# Altium project B001AA.PrjPcb (part 1 of 3)
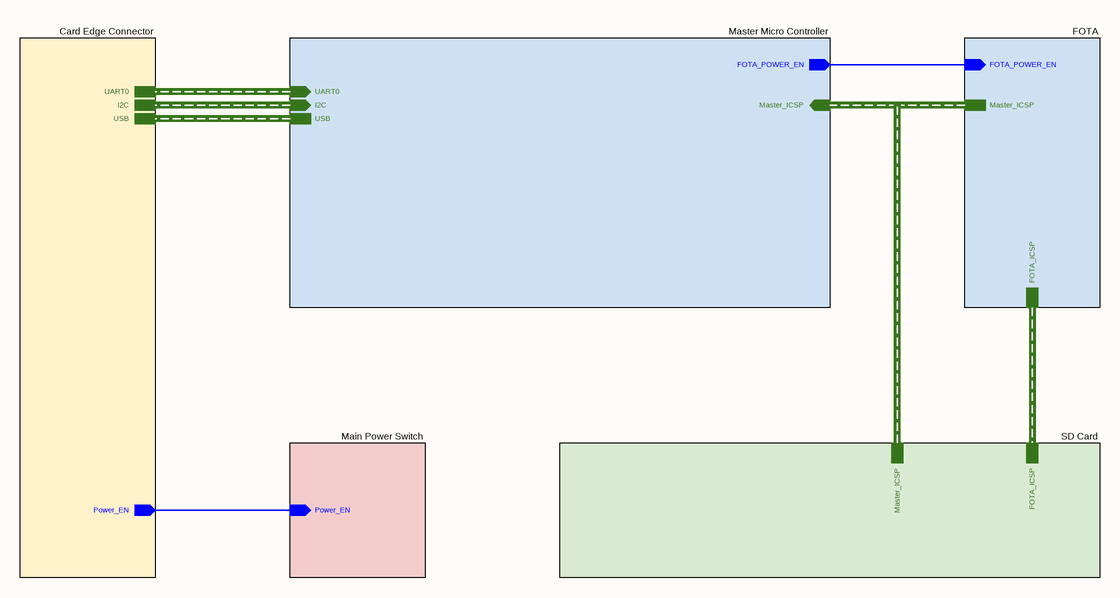
[diagram p0: Blok Diagram.SchDoc]
Address1_: Buyuk Kayacik Mah. 4. OSB; Address2_: 103. Cad. No : 12; Address3_: Selcuklu / Konya; Address4_: Türkiye; Copyright_: Copyright 2022 STF Tarim (Commercial Secret); Customer_: STF Irrigation; Engineer_: Gunce Akkoyun; Git_Repo_Address_: www.github.com/akkoyun/B001AA; Module_ID_: B001AA; Organization_: STF Res-Dev; Product_Desc_: --; Product_ID_: --; Revision_: 00.00.01; Version_: R1
28 sheets, 194 parts. Net scope: hierarchical (ports join the sheet entries above them; power ports are global).
Board file: B001AA.PcbDoc
Sheets:
  Blok Diagram.SchDoc
    Card Edge Connector = Card Edge Connector.SchDoc
      Port L Output Port = Port L Output Port.SchDoc
      Port K Output Port = Port K Output Port.SchDoc
      Port F Output Port = Port F Output Port.SchDoc
      Serial Output Ports = Serial Output Ports.SchDoc
      GSM Output Port = GSM Output Port.SchDoc
    FOTA = FOTA.SchDoc
      FOTA MCU LED Driver = FOTA LED Driver.SchDoc
      FOTA Power Switch = FOTA Microcontroller Power Switch.SchDoc
      FOTA Micro Controller = FOTA Micro Controller.SchDoc
      FOTA Burn Buffer = FOTA Burn Buffer.SchDoc
    Master Micro Controller = Master Micro Controller.SchDoc
      Buzzer = Buzzer.SchDoc
      Master MCU LED Driver = Master MicroController LED Driver.SchDoc
      I2C Network = I2C Block Diagram.SchDoc
        I2C Multiplexer = I2C Multiplexer.SchDoc
        I2C RTC = I2C Real Time Clock.SchDoc
        I2C Serial ID = I2C Serial ID EEPROM.SchDoc
        I2C TH Sensor = I2C Temperature Sensor.SchDoc
      Master MicroController Core = Master Micro Controller Core.SchDoc
      Master MCU UnUsed Pins = UnUsed MicroController Pins.SchDoc
      USB Connector = USB Connector.SchDoc
      USB to Serial Converter = Serial to USB Converter.SchDoc
    SD Card = SD Card Block.SchDoc
      SD Card Multiplexer = SD Card Multiplexer.SchDoc
      SD Card = SD Card.SchDoc
    Main Power Switch = Power Switch.SchDoc

## Sheet Blok Diagram.SchDoc: B001AA Main Block Diagram
size 292 x 193 mm; SheetNumber: 1; SheetTotal: 28

### Sub-sheets
Card Edge Connector = Card Edge Connector.SchDoc: I2C (harness I2C), UART0 (harness UART0), USB (harness USB), Power_EN (out)
FOTA = FOTA.SchDoc: FOTA_ICSP (harness FOTA_ICSP), Master_ICSP (harness Master_ICSP), FOTA_POWER_EN (in)
Main Power Switch = Power Switch.SchDoc: Power_EN (in)
Master Micro Controller = Master Micro Controller.SchDoc: UART0 (in, harness UART0), I2C (in, harness I2C), Master_ICSP (in, harness Master_ICSP), FOTA_POWER_EN (out), USB (harness USB)
SD Card = SD Card Block.SchDoc: Master_ICSP (harness Master_ICSP), FOTA_ICSP (harness FOTA_ICSP)

### Nets
FOTA_POWER_EN: sheet FOTA/FOTA_POWER_EN, sheet Master Micro Controller/FOTA_POWER_EN
Power_EN: sheet Card Edge Connector/Power_EN, sheet Main Power Switch/Power_EN

### Buses and harness runs
harness sheet Card Edge Connector/I2C = sheet Master Micro Controller/I2C
harness sheet Card Edge Connector/UART0 = sheet Master Micro Controller/UART0
harness sheet Card Edge Connector/USB = sheet Master Micro Controller/USB
harness sheet FOTA/FOTA_ICSP = sheet SD Card/FOTA_ICSP
harness sheet FOTA/Master_ICSP = sheet Master Micro Controller/Master_ICSP = sheet SD Card/Master_ICSP

### Notes on the sheet
- © 2021 All rights reserved.
  This document may not, in whole or in part, be copied, photocopied, reproduced, translated or converted to any electronic or machine readable from without prior written permission of Mehmet Günce Akkoyun.
  Engineer contact : akkoyun@me.com
- Property of
- Engineer :
- Date :
- Size :
- A4
- Time :
- Project :
- Page :
- /
- Customer :
- Product ID :
- Module ID :
- Version :
- File :
- Revision :

## Sheet Card Edge Connector.SchDoc: Card Edge Connector
size 292 x 193 mm; SheetNumber: 2; SheetTotal: 28
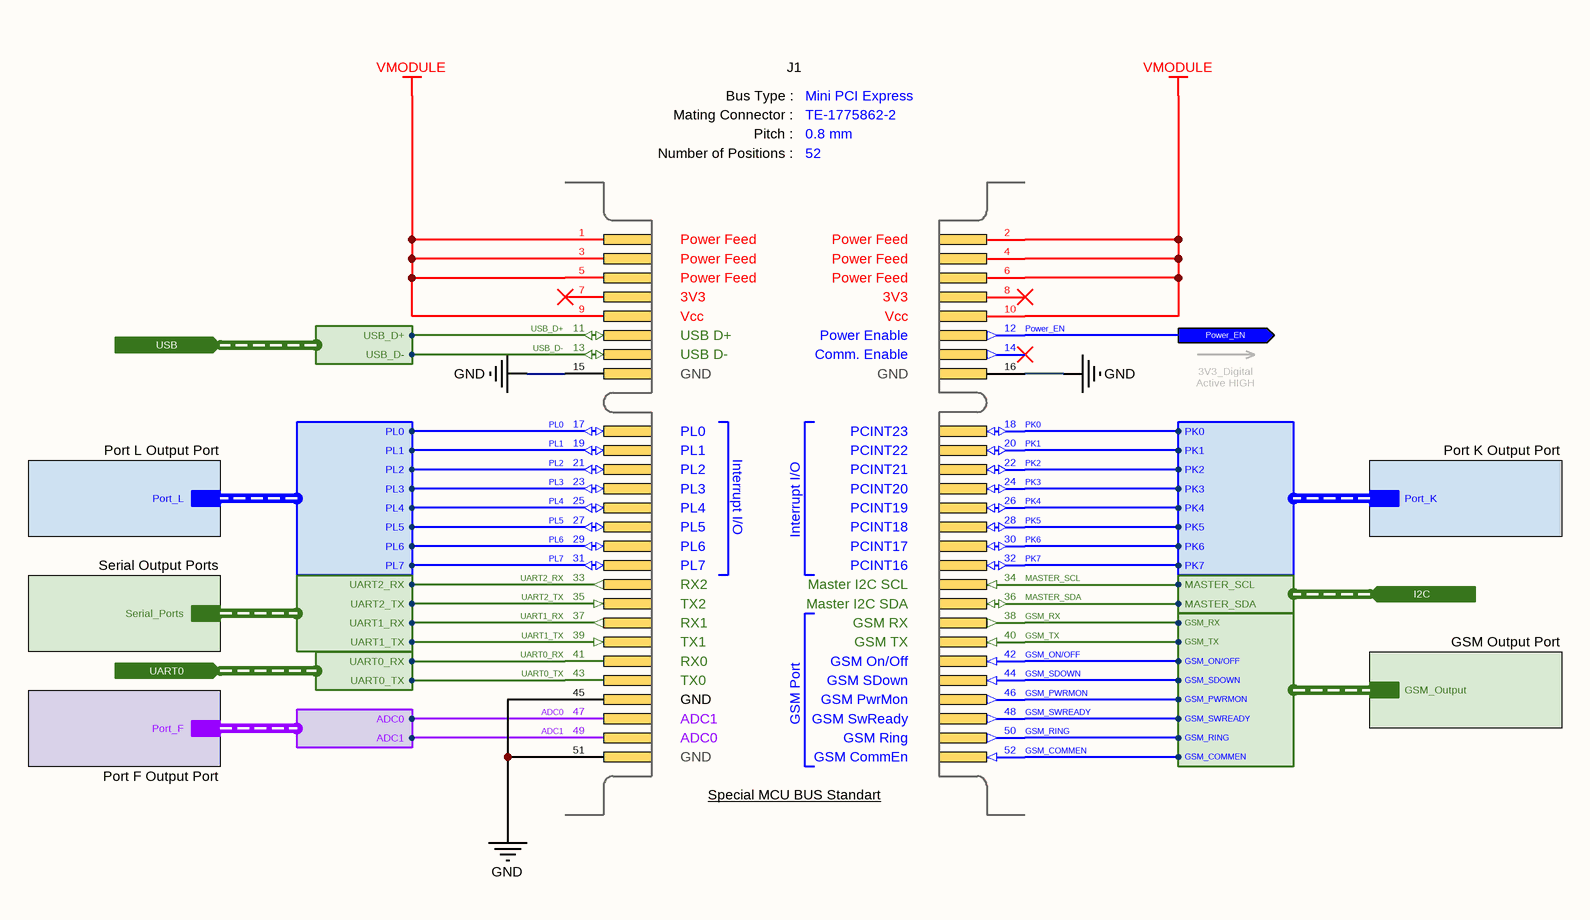
[diagram p1: Card Edge Connector.SchDoc]

### Parts
J1  BUS Type: Mini PCI Express  Mating Connector: TE-1775862-2  Pitch: 0.8 mm  Number of Positions: 52  [PCB - Mini PCI Express]  (hidden comment: PCI-E Connector)  (no BOM)

### Sub-sheets
GSM Output Port = GSM Output Port.SchDoc: GSM_Output (harness GSM_Output)
Port F Output Port = Port F Output Port.SchDoc: Port_F (harness Port_F)
Port K Output Port = Port K Output Port.SchDoc: Port_K (harness Port_K)
Port L Output Port = Port L Output Port.SchDoc: Port_L (harness Port_L)
Serial Output Ports = Serial Output Ports.SchDoc: Serial_Ports (harness Serial_Ports)

### Ports
I2C (in, harness I2C), Power_EN (out), UART0 (in, harness UART0), USB (in, harness USB)

### Harnesses
GSM_Output: GSM_SDOWN, GSM_ON/OFF, GSM_TX, GSM_RX, GSM_PWRMON, GSM_SWREADY, GSM_RING, GSM_COMMEN
Port_L: PL3, PL2, PL1, PL0, PL4, PL5, PL6, PL7
Port_K: PK3, PK2, PK1, PK0, PK4, PK5, PK6, PK7
Port_F: ADC1, ADC0
Serial_Ports: UART1_TX, UART1_RX, UART2_RX, UART2_TX
UART0: UART0_RX, UART0_TX
I2C: MASTER_SDA, MASTER_SCL
USB: USB_D+, USB_D-

### Nets
GND: J1.15(Pin-15) J1.16(Pin-16) J1.45(Pin-45) J1.51(Pin-51)
VMODULE: J1.1(Pin-1) J1.2(Pin-2) J1.3(Pin-3) J1.4(Pin-4) J1.5(Pin-5) J1.6(Pin-6) J1.9(Pin-9) J1.10(Pin-10)
ADC0: J1.47(Pin-47) ; sheet Port F Output Port/Port_F.ADC0
ADC1: J1.49(Pin-49) ; sheet Port F Output Port/Port_F.ADC1
GSM_COMMEN: J1.52(Pin-52) ; sheet GSM Output Port/GSM_Output.GSM_COMMEN
GSM_ON/OFF: J1.42(Pin-42) ; sheet GSM Output Port/GSM_Output.GSM_ON/OFF
GSM_PWRMON: J1.46(Pin-46) ; sheet GSM Output Port/GSM_Output.GSM_PWRMON
GSM_RING: J1.50(Pin-50) ; sheet GSM Output Port/GSM_Output.GSM_RING
GSM_RX: J1.38(Pin-38) ; sheet GSM Output Port/GSM_Output.GSM_RX
GSM_SDOWN: J1.44(Pin-44) ; sheet GSM Output Port/GSM_Output.GSM_SDOWN
GSM_SWREADY: J1.48(Pin-48) ; sheet GSM Output Port/GSM_Output.GSM_SWREADY
GSM_TX: J1.40(Pin-40) ; sheet GSM Output Port/GSM_Output.GSM_TX
MASTER_SCL: J1.34(Pin-34) ; port I2C.MASTER_SCL
MASTER_SDA: J1.36(Pin-36) ; port I2C.MASTER_SDA
PK0: J1.18(Pin-18) ; sheet Port K Output Port/Port_K.PK0
PK1: J1.20(Pin-20) ; sheet Port K Output Port/Port_K.PK1
PK2: J1.22(Pin-22) ; sheet Port K Output Port/Port_K.PK2
PK3: J1.24(Pin-24) ; sheet Port K Output Port/Port_K.PK3
PK4: J1.26(Pin-26) ; sheet Port K Output Port/Port_K.PK4
PK5: J1.28(Pin-28) ; sheet Port K Output Port/Port_K.PK5
PK6: J1.30(Pin-30) ; sheet Port K Output Port/Port_K.PK6
PK7: J1.32(Pin-32) ; sheet Port K Output Port/Port_K.PK7
PL0: J1.17(Pin-17) ; sheet Port L Output Port/Port_L.PL0
PL1: J1.19(Pin-19) ; sheet Port L Output Port/Port_L.PL1
PL2: J1.21(Pin-21) ; sheet Port L Output Port/Port_L.PL2
PL3: J1.23(Pin-23) ; sheet Port L Output Port/Port_L.PL3
PL4: J1.25(Pin-25) ; sheet Port L Output Port/Port_L.PL4
PL5: J1.27(Pin-27) ; sheet Port L Output Port/Port_L.PL5
PL6: J1.29(Pin-29) ; sheet Port L Output Port/Port_L.PL6
PL7: J1.31(Pin-31) ; sheet Port L Output Port/Port_L.PL7
Power_EN: J1.12(Pin-12) ; port Power_EN
UART0_RX: J1.41(Pin-41) ; port UART0.UART0_RX
UART0_TX: J1.43(Pin-43) ; port UART0.UART0_TX
UART1_RX: J1.37(Pin-37) ; sheet Serial Output Ports/Serial_Ports.UART1_RX
UART1_TX: J1.39(Pin-39) ; sheet Serial Output Ports/Serial_Ports.UART1_TX
UART2_RX: J1.33(Pin-33) ; sheet Serial Output Ports/Serial_Ports.UART2_RX
UART2_TX: J1.35(Pin-35) ; sheet Serial Output Ports/Serial_Ports.UART2_TX
USB_D+: J1.11(Pin-11) ; port USB.USB_D+
USB_D-: J1.13(Pin-13) ; port USB.USB_D-

Not connected (* = marked no-connect by the designer): J1 7(Pin-7)* 8(Pin-8)* 14(Pin-14)*

### Notes on the sheet
- 3V3_Digital
  Active HIGH
- © 2021 All rights reserved.
  This document may not, in whole or in part, be copied, photocopied, reproduced, translated or converted to any electronic or machine readable from without prior written permission of Mehmet Günce Akkoyun.
  Engineer contact : akkoyun@me.com
- Property of
- Engineer :
- Date :
- Size :
- A4
- Time :
- Project :
- Page :
- /
- Customer :
- Product ID :
- Module ID :
- Version :
- File :
- Revision :
- (in symbol Connector - Mini PCI-E [MCU]) Bus Type :; Mating Connector :; Pitch :; Number of Positions :; Power Feed; 3V3; Vcc; USB D+; Power Enable; USB D-; Comm. Enable; GND; PL0; PCINT23; PL1; PCINT22; Interrupt I/O; PL2; PCINT21; PL3; PCINT20; PL4; PCINT19; PL5; PCINT18; PL6; PCINT17; PL7; PCINT16; RX2; Master I2C SCL; TX2; Master I2C SDA; RX1; GSM RX; TX1; GSM TX; RX0; GSM Port; GSM On/Off; TX0; GSM SDown; GSM PwrMon; ADC1; GSM SwReady; ADC0; GSM Ring; GSM CommEn; Special MCU BUS Standart

### Library data of the parts
J1 = Connector - Mini PCI-E [MCU]: Mini PCI-Express gold finger connector.; System: Connector

## Sheet Port L Output Port.SchDoc: Port L Output Port
size 292 x 193 mm; SheetNumber: 5; SheetTotal: 28
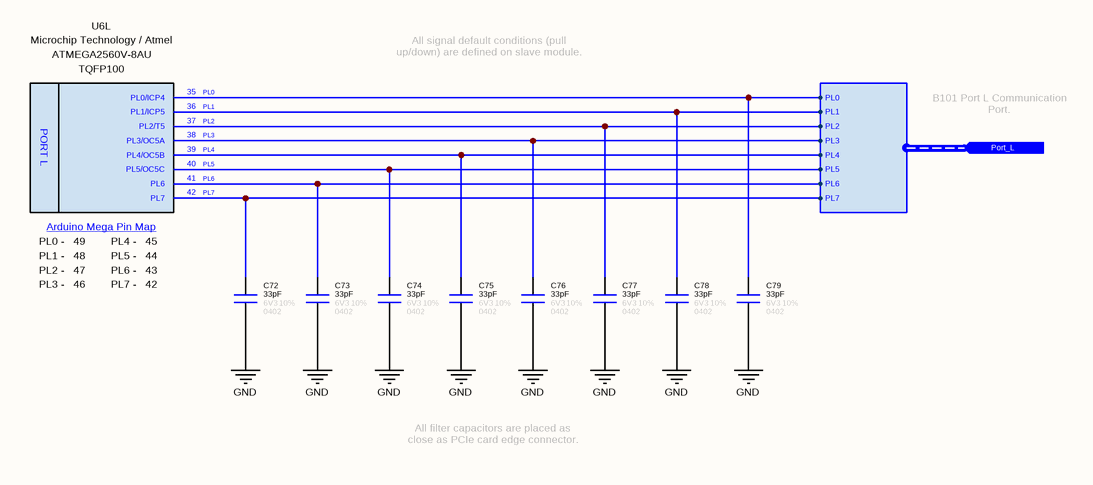
[diagram p2: Port L Output Port.SchDoc]

### Parts
C72  value 33pF  Tolerance: 10%  Case: 0402  Voltage: 6V3  [CAPACITOR_0402]  (hidden comment: Capacitor - 33pF [0402] (Ceramic))
C73  value 33pF  Tolerance: 10%  Case: 0402  Voltage: 6V3  [CAPACITOR_0402]  (hidden comment: Capacitor - 33pF [0402] (Ceramic))
C74  value 33pF  Tolerance: 10%  Case: 0402  Voltage: 6V3  [CAPACITOR_0402]  (hidden comment: Capacitor - 33pF [0402] (Ceramic))
C75  value 33pF  Tolerance: 10%  Case: 0402  Voltage: 6V3  [CAPACITOR_0402]  (hidden comment: Capacitor - 33pF [0402] (Ceramic))
C76  value 33pF  Tolerance: 10%  Case: 0402  Voltage: 6V3  [CAPACITOR_0402]  (hidden comment: Capacitor - 33pF [0402] (Ceramic))
C77  value 33pF  Tolerance: 10%  Case: 0402  Voltage: 6V3  [CAPACITOR_0402]  (hidden comment: Capacitor - 33pF [0402] (Ceramic))
C78  value 33pF  Tolerance: 10%  Case: 0402  Voltage: 6V3  [CAPACITOR_0402]  (hidden comment: Capacitor - 33pF [0402] (Ceramic))
C79  value 33pF  Tolerance: 10%  Case: 0402  Voltage: 6V3  [CAPACITOR_0402]  (hidden comment: Capacitor - 33pF [0402] (Ceramic))
U6  Manufacturer Name: Microchip Technology / Atmel  Case: TQFP100  [TQFP-100]  (hidden comment: ATMEGA2560V-8AU)  (part L of 16)

### Ports
Port_L (in, harness Port_L)

### Harnesses
Port_L: PL3, PL2, PL1, PL0, PL4, PL5, PL6, PL7

### Nets
GND: C72.1 C73.1 C74.1 C75.1 C76.1 C77.1 C78.1 C79.1
PL0: C79.2 U6.35(PL0/ICP4) ; port Port_L.PL0
PL1: C78.2 U6.36(PL1/ICP5) ; port Port_L.PL1
PL2: C77.2 U6.37(PL2/T5) ; port Port_L.PL2
PL3: C76.2 U6.38(PL3/OC5A) ; port Port_L.PL3
PL4: C75.2 U6.39(PL4/OC5B) ; port Port_L.PL4
PL5: C74.2 U6.40(PL5/OC5C) ; port Port_L.PL5
PL6: C73.2 U6.41(PL6) ; port Port_L.PL6
PL7: C72.2 U6.42(PL7) ; port Port_L.PL7

### Notes on the sheet
- All signal default conditions (pull up/down) are defined on slave module.
- B101 Port L Communication Port.
- All filter capacitors are placed as close as PCIe card edge connector.
- © 2021 All rights reserved.
  This document may not, in whole or in part, be copied, photocopied, reproduced, translated or converted to any electronic or machine readable from without prior written permission of Mehmet Günce Akkoyun.
  Engineer contact : akkoyun@me.com
- Property of
- Engineer :
- Date :
- Size :
- A4
- Time :
- Project :
- Page :
- /
- Customer :
- Product ID :
- Module ID :
- Version :
- File :
- Revision :
- (in symbol IC - AtMega2560V-8AU, part L) PORT L; Arduino Mega Pin Map; PL0 -; PL4 -; PL1 -; PL5 -; PL2 -; PL6 -; PL3 -; PL7 -

### Library data of the parts
C72-C79 = Capacitor - 33pF [0402-6V3]: Manufacturer Name: Kemet; Manufacturer Part Number: C0402C330J9RACAUTO; ComponentLink1Description: DataSheet; ComponentLink1URL: https://api.kemet.com/component-edge/download/datasheet/C0402C330J9RACAUTO.pdf; ComponentLink2Description: Mouser; ComponentLink2URL: https://www.mouser.com/Search/Refine.aspx?Keyword=80-C0402C330J9RAUTO
U6 = IC - AtMega2560V-8AU: ATmega Series 256 KB Flash 8 KB SRAM 8 MHz 8-Bit Microcontroller - TQFP-100; Program Memory Size: 256 kB; Core: AVR; Operating Supply Voltage: 2.7 V to 5.5 V; Maximum Clock Frequency: 8 MHz; Maximum Operating Temperature: + 85 C; Product Type: MicroControllers; Minimum Operating Temperature: - 40 C; Manufacturer Part Number: ATMEGA2560V-8AU

## Sheet Port K Output Port.SchDoc: Port K Output Port
size 292 x 193 mm; SheetNumber: 4; SheetTotal: 28
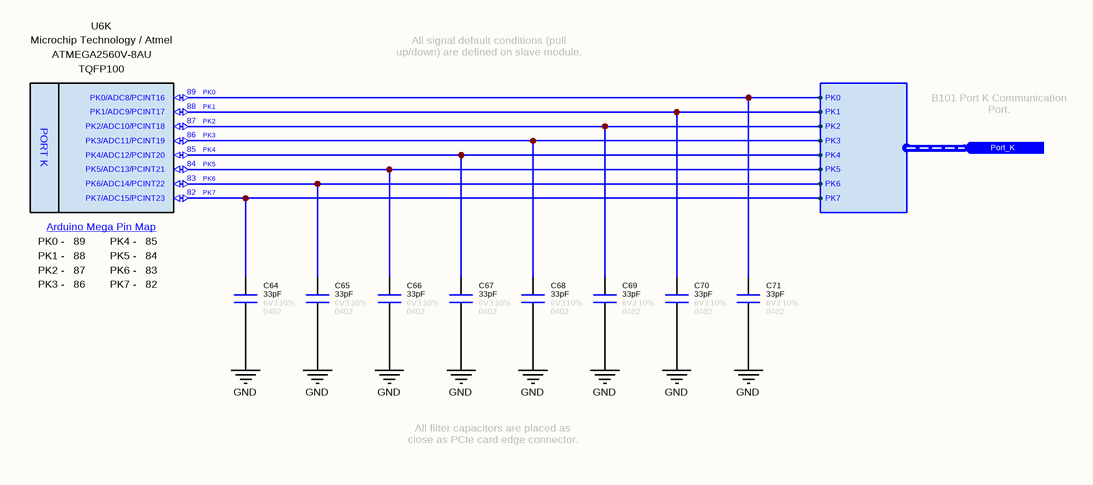
[diagram p3: Port K Output Port.SchDoc]

### Parts
C64  value 33pF  Tolerance: 10%  Case: 0402  Voltage: 6V3  [CAPACITOR_0402]  (hidden comment: Capacitor - 33pF [0402] (Ceramic))
C65  value 33pF  Tolerance: 10%  Case: 0402  Voltage: 6V3  [CAPACITOR_0402]  (hidden comment: Capacitor - 33pF [0402] (Ceramic))
C66  value 33pF  Tolerance: 10%  Case: 0402  Voltage: 6V3  [CAPACITOR_0402]  (hidden comment: Capacitor - 33pF [0402] (Ceramic))
C67  value 33pF  Tolerance: 10%  Case: 0402  Voltage: 6V3  [CAPACITOR_0402]  (hidden comment: Capacitor - 33pF [0402] (Ceramic))
C68  value 33pF  Tolerance: 10%  Case: 0402  Voltage: 6V3  [CAPACITOR_0402]  (hidden comment: Capacitor - 33pF [0402] (Ceramic))
C69  value 33pF  Tolerance: 10%  Case: 0402  Voltage: 6V3  [CAPACITOR_0402]  (hidden comment: Capacitor - 33pF [0402] (Ceramic))
C70  value 33pF  Tolerance: 10%  Case: 0402  Voltage: 6V3  [CAPACITOR_0402]  (hidden comment: Capacitor - 33pF [0402] (Ceramic))
C71  value 33pF  Tolerance: 10%  Case: 0402  Voltage: 6V3  [CAPACITOR_0402]  (hidden comment: Capacitor - 33pF [0402] (Ceramic))
U6  Manufacturer Name: Microchip Technology / Atmel  Case: TQFP100  [TQFP-100]  (hidden comment: ATMEGA2560V-8AU)  (part K of 16)

### Ports
Port_K (in, harness Port_K)

### Harnesses
Port_K: PK3, PK2, PK1, PK0, PK4, PK5, PK6, PK7

### Nets
GND: C64.1 C65.1 C66.1 C67.1 C68.1 C69.1 C70.1 C71.1
PK0: C71.2 U6.89(PK0/ADC8/PCINT16) ; port Port_K.PK0
PK1: C70.2 U6.88(PK1/ADC9/PCINT17) ; port Port_K.PK1
PK2: C69.2 U6.87(PK2/ADC10/PCINT18) ; port Port_K.PK2
PK3: C68.2 U6.86(PK3/ADC11/PCINT19) ; port Port_K.PK3
PK4: C67.2 U6.85(PK4/ADC12/PCINT20) ; port Port_K.PK4
PK5: C66.2 U6.84(PK5/ADC13/PCINT21) ; port Port_K.PK5
PK6: C65.2 U6.83(PK6/ADC14/PCINT22) ; port Port_K.PK6
PK7: C64.2 U6.82(PK7/ADC15/PCINT23) ; port Port_K.PK7

### Notes on the sheet
- All signal default conditions (pull up/down) are defined on slave module.
- B101 Port K Communication Port.
- All filter capacitors are placed as close as PCIe card edge connector.
- © 2021 All rights reserved.
  This document may not, in whole or in part, be copied, photocopied, reproduced, translated or converted to any electronic or machine readable from without prior written permission of Mehmet Günce Akkoyun.
  Engineer contact : akkoyun@me.com
- Property of
- Engineer :
- Date :
- Size :
- A4
- Time :
- Project :
- Page :
- /
- Customer :
- Product ID :
- Module ID :
- Version :
- File :
- Revision :
- (in symbol IC - AtMega2560V-8AU, part K) PORT K; Arduino Mega Pin Map; PK0 -; PK4 -; PK1 -; PK5 -; PK2 -; PK6 -; PK3 -; PK7 -

### Library data of the parts
C64-C71 = Capacitor - 33pF [0402-6V3]: as C72 on sheet Port L Output Port; ComponentLink1Description: DataSheet; ComponentLink1URL: https://api.kemet.com/component-edge/download/datasheet/C0402C330J9RACAUTO.pdf; ComponentLink2Description: Mouser; ComponentLink2URL: https://www.mouser.com/Search/Refine.aspx?Keyword=80-C0402C330J9RAUTO
U6 = IC - AtMega2560V-8AU: as U6 on sheet Port L Output Port; Maximum Operating Temperature: + 85 C; Product Type: MicroControllers; Minimum Operating Temperature: - 40 C; Manufacturer Part Number: ATMEGA2560V-8AU

## Sheet Port F Output Port.SchDoc: Port F Output Port
size 292 x 193 mm; SheetNumber: 6; SheetTotal: 28
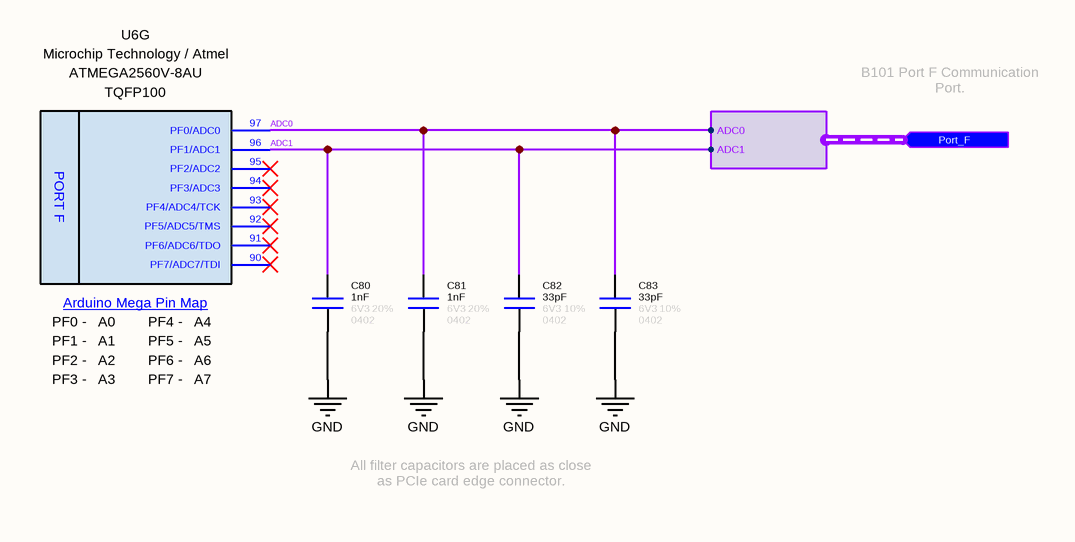
[diagram p4: Port F Output Port.SchDoc]

### Parts
C80  value 1nF  Tolerance: 20%  Case: 0402  Voltage: 6V3  [CAPACITOR_0402]  (hidden comment: Capacitor - 1nF [0402] (Ceramic))
C81  value 1nF  Tolerance: 20%  Case: 0402  Voltage: 6V3  [CAPACITOR_0402]  (hidden comment: Capacitor - 1nF [0402] (Ceramic))
C82  value 33pF  Tolerance: 10%  Case: 0402  Voltage: 6V3  [CAPACITOR_0402]  (hidden comment: Capacitor - 33pF [0402] (Ceramic))
C83  value 33pF  Tolerance: 10%  Case: 0402  Voltage: 6V3  [CAPACITOR_0402]  (hidden comment: Capacitor - 33pF [0402] (Ceramic))
U6  Manufacturer Name: Microchip Technology / Atmel  Case: TQFP100  [TQFP-100]  (hidden comment: ATMEGA2560V-8AU)  (part G of 16)

### Ports
Port_F (in, harness Port_F)

### Harnesses
Port_F: ADC1, ADC0

### Nets
GND: C80.1 C81.1 C82.1 C83.1
ADC0: C81.2 C83.2 U6.97(PF0/ADC0) ; port Port_F.ADC0
ADC1: C80.2 C82.2 U6.96(PF1/ADC1) ; port Port_F.ADC1

Not connected (* = marked no-connect by the designer): U6 90(PF7/ADC7/TDI)* 91(PF6/ADC6/TDO)* 92(PF5/ADC5/TMS)* 93(PF4/ADC4/TCK)* 94(PF3/ADC3)* 95(PF2/ADC2)*

### Notes on the sheet
- B101 Port F Communication Port.
- All filter capacitors are placed as close as PCIe card edge connector.
- © 2021 All rights reserved.
  This document may not, in whole or in part, be copied, photocopied, reproduced, translated or converted to any electronic or machine readable from without prior written permission of Mehmet Günce Akkoyun.
  Engineer contact : akkoyun@me.com
- Property of
- Engineer :
- Date :
- Size :
- A4
- Time :
- Project :
- Page :
- /
- Customer :
- Product ID :
- Module ID :
- Version :
- File :
- Revision :
- (in symbol IC - AtMega2560V-8AU, part G) PORT F; Arduino Mega Pin Map; PF0 -; A0; PF4 -; A4; PF1 -; A1; PF5 -; A5; PF2 -; A2; PF6 -; A6; PF3 -; A3; PF7 -; A7

### Library data of the parts
C80 C81 = Capacitor - 1nF [0402-6V3]: Manufacturer Name: AVX; Manufacturer Part Number: 04026C102MAT2A; ComponentLink1Description: DataSheet; ComponentLink1URL: https://www.mouser.com.tr/datasheet/2/40/X7RDielectric-777024.pdf
C82 C83 = Capacitor - 33pF [0402-6V3]: as C72 on sheet Port L Output Port; ComponentLink1Description: DataSheet; ComponentLink1URL: https://api.kemet.com/component-edge/download/datasheet/C0402C330J9RACAUTO.pdf; ComponentLink2Description: Mouser; ComponentLink2URL: https://www.mouser.com/Search/Refine.aspx?Keyword=80-C0402C330J9RAUTO
U6 = IC - AtMega2560V-8AU: as U6 on sheet Port L Output Port; Maximum Operating Temperature: + 85 C; Product Type: MicroControllers; Minimum Operating Temperature: - 40 C; Manufacturer Part Number: ATMEGA2560V-8AU

## Sheet Serial Output Ports.SchDoc: Serial Output Ports
size 292 x 193 mm; SheetNumber: 7; SheetTotal: 28
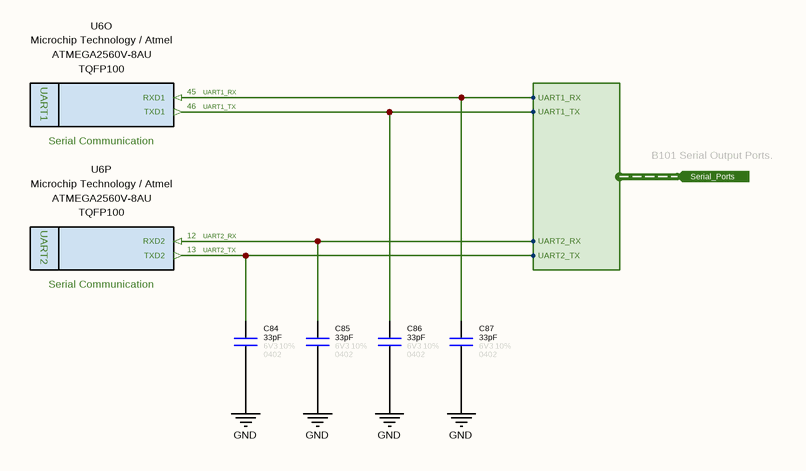
[diagram p5: Serial Output Ports.SchDoc]

### Parts
C84  value 33pF  Tolerance: 10%  Case: 0402  Voltage: 6V3  [CAPACITOR_0402]  (hidden comment: Capacitor - 33pF [0402] (Ceramic))
C85  value 33pF  Tolerance: 10%  Case: 0402  Voltage: 6V3  [CAPACITOR_0402]  (hidden comment: Capacitor - 33pF [0402] (Ceramic))
C86  value 33pF  Tolerance: 10%  Case: 0402  Voltage: 6V3  [CAPACITOR_0402]  (hidden comment: Capacitor - 33pF [0402] (Ceramic))
C87  value 33pF  Tolerance: 10%  Case: 0402  Voltage: 6V3  [CAPACITOR_0402]  (hidden comment: Capacitor - 33pF [0402] (Ceramic))
U6  Manufacturer Name: Microchip Technology / Atmel  Case: TQFP100  [TQFP-100]  (hidden comment: ATMEGA2560V-8AU)  (parts O,P of 16)

### Ports
Serial_Ports (in, harness Serial_Ports)

### Harnesses
Serial_Ports: UART1_TX, UART1_RX, UART2_RX, UART2_TX

### Nets
GND: C84.1 C85.1 C86.1 C87.1
UART1_RX: C87.2 U6.45(RXD1) ; port Serial_Ports.UART1_RX
UART1_TX: C86.2 U6.46(TXD1) ; port Serial_Ports.UART1_TX
UART2_RX: C85.2 U6.12(RXD2) ; port Serial_Ports.UART2_RX
UART2_TX: C84.2 U6.13(TXD2) ; port Serial_Ports.UART2_TX

### Notes on the sheet
- B101 Serial Output Ports.
- © 2021 All rights reserved.
  This document may not, in whole or in part, be copied, photocopied, reproduced, translated or converted to any electronic or machine readable from without prior written permission of Mehmet Günce Akkoyun.
  Engineer contact : akkoyun@me.com
- Property of
- Engineer :
- Date :
- Size :
- A4
- Time :
- Project :
- Page :
- /
- Customer :
- Product ID :
- Module ID :
- Version :
- File :
- Revision :
- (in symbol IC - AtMega2560V-8AU, part O) UART1; Serial Communication
- (in symbol IC - AtMega2560V-8AU, part P) UART2; Serial Communication

### Library data of the parts
C84-C87 = Capacitor - 33pF [0402-6V3]: as C72 on sheet Port L Output Port; ComponentLink1Description: DataSheet; ComponentLink1URL: https://api.kemet.com/component-edge/download/datasheet/C0402C330J9RACAUTO.pdf; ComponentLink2Description: Mouser; ComponentLink2URL: https://www.mouser.com/Search/Refine.aspx?Keyword=80-C0402C330J9RAUTO
U6 = IC - AtMega2560V-8AU: as U6 on sheet Port L Output Port; Maximum Operating Temperature: + 85 C; Product Type: MicroControllers; Minimum Operating Temperature: - 40 C; Manufacturer Part Number: ATMEGA2560V-8AU

## Sheet GSM Output Port.SchDoc: GSM Output Port
size 292 x 193 mm; SheetNumber: 3; SheetTotal: 28
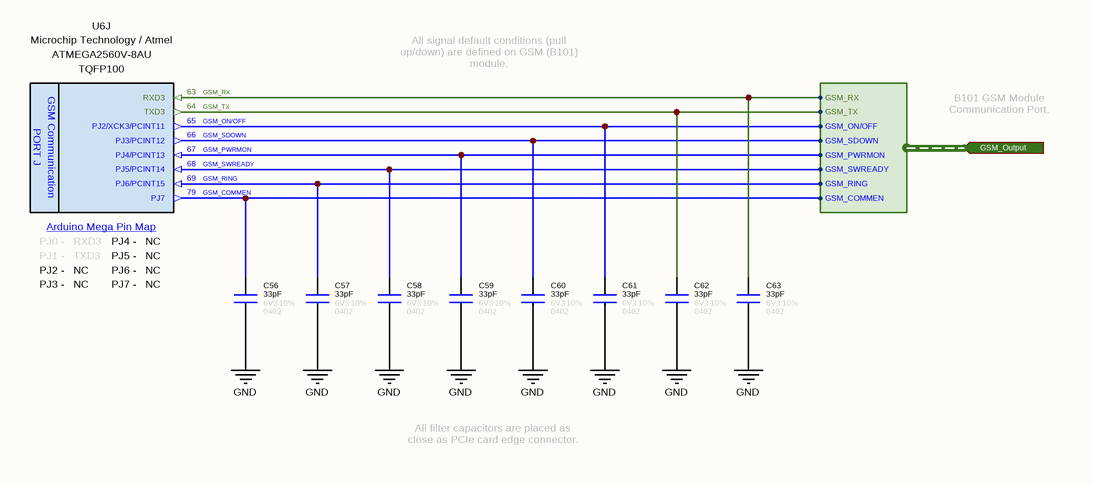
[diagram p6: GSM Output Port.SchDoc]

### Parts
C56  value 33pF  Tolerance: 10%  Case: 0402  Voltage: 6V3  [CAPACITOR_0402]  (hidden comment: Capacitor - 33pF [0402] (Ceramic))
C57  value 33pF  Tolerance: 10%  Case: 0402  Voltage: 6V3  [CAPACITOR_0402]  (hidden comment: Capacitor - 33pF [0402] (Ceramic))
C58  value 33pF  Tolerance: 10%  Case: 0402  Voltage: 6V3  [CAPACITOR_0402]  (hidden comment: Capacitor - 33pF [0402] (Ceramic))
C59  value 33pF  Tolerance: 10%  Case: 0402  Voltage: 6V3  [CAPACITOR_0402]  (hidden comment: Capacitor - 33pF [0402] (Ceramic))
C60  value 33pF  Tolerance: 10%  Case: 0402  Voltage: 6V3  [CAPACITOR_0402]  (hidden comment: Capacitor - 33pF [0402] (Ceramic))
C61  value 33pF  Tolerance: 10%  Case: 0402  Voltage: 6V3  [CAPACITOR_0402]  (hidden comment: Capacitor - 33pF [0402] (Ceramic))
C62  value 33pF  Tolerance: 10%  Case: 0402  Voltage: 6V3  [CAPACITOR_0402]  (hidden comment: Capacitor - 33pF [0402] (Ceramic))
C63  value 33pF  Tolerance: 10%  Case: 0402  Voltage: 6V3  [CAPACITOR_0402]  (hidden comment: Capacitor - 33pF [0402] (Ceramic))
U6  Manufacturer Name: Microchip Technology / Atmel  Case: TQFP100  [TQFP-100]  (hidden comment: ATMEGA2560V-8AU)  (part J of 16)

### Ports
GSM_Output (in, harness GSM_Output)

### Harnesses
GSM_Output: GSM_SDOWN, GSM_ON/OFF, GSM_TX, GSM_RX, GSM_PWRMON, GSM_SWREADY, GSM_RING, GSM_COMMEN

### Nets
GND: C56.1 C57.1 C58.1 C59.1 C60.1 C61.1 C62.1 C63.1
GSM_COMMEN: C56.2 U6.79(PJ7) ; port GSM_Output.GSM_COMMEN
GSM_ON/OFF: C61.2 U6.65(PJ2/XCK3/PCINT11) ; port GSM_Output.GSM_ON/OFF
GSM_PWRMON: C59.2 U6.67(PJ4/PCINT13) ; port GSM_Output.GSM_PWRMON
GSM_RING: C57.2 U6.69(PJ6/PCINT15) ; port GSM_Output.GSM_RING
GSM_RX: C63.2 U6.63(RXD3) ; port GSM_Output.GSM_RX
GSM_SDOWN: C60.2 U6.66(PJ3/PCINT12) ; port GSM_Output.GSM_SDOWN
GSM_SWREADY: C58.2 U6.68(PJ5/PCINT14) ; port GSM_Output.GSM_SWREADY
GSM_TX: C62.2 U6.64(TXD3) ; port GSM_Output.GSM_TX

### Notes on the sheet
- All signal default conditions (pull up/down) are defined on GSM (B101) module.
- B101 GSM Module Communication Port.
- All filter capacitors are placed as close as PCIe card edge connector.
- © 2021 All rights reserved.
  This document may not, in whole or in part, be copied, photocopied, reproduced, translated or converted to any electronic or machine readable from without prior written permission of Mehmet Günce Akkoyun.
  Engineer contact : akkoyun@me.com
- Property of
- Engineer :
- Date :
- Size :
- A4
- Time :
- Project :
- Page :
- /
- Customer :
- Product ID :
- Module ID :
- Version :
- File :
- Revision :
- (in symbol IC - AtMega2560V-8AU, part J) PORT J; GSM Communication; Arduino Mega Pin Map; PJ0 -; PJ4 -; NC; PJ1 -; PJ5 -; PJ2 -; PJ6 -; PJ3 -; PJ7 -

### Library data of the parts
C56-C63 = Capacitor - 33pF [0402-6V3]: as C72 on sheet Port L Output Port; ComponentLink1Description: DataSheet; ComponentLink1URL: https://api.kemet.com/component-edge/download/datasheet/C0402C330J9RACAUTO.pdf; ComponentLink2Description: Mouser; ComponentLink2URL: https://www.mouser.com/Search/Refine.aspx?Keyword=80-C0402C330J9RAUTO
U6 = IC - AtMega2560V-8AU: as U6 on sheet Port L Output Port; Maximum Operating Temperature: + 85 C; Product Type: MicroControllers; Minimum Operating Temperature: - 40 C; Manufacturer Part Number: ATMEGA2560V-8AU

## Sheet FOTA.SchDoc: FOTA
size 292 x 193 mm; SheetNumber: 21; SheetTotal: 28
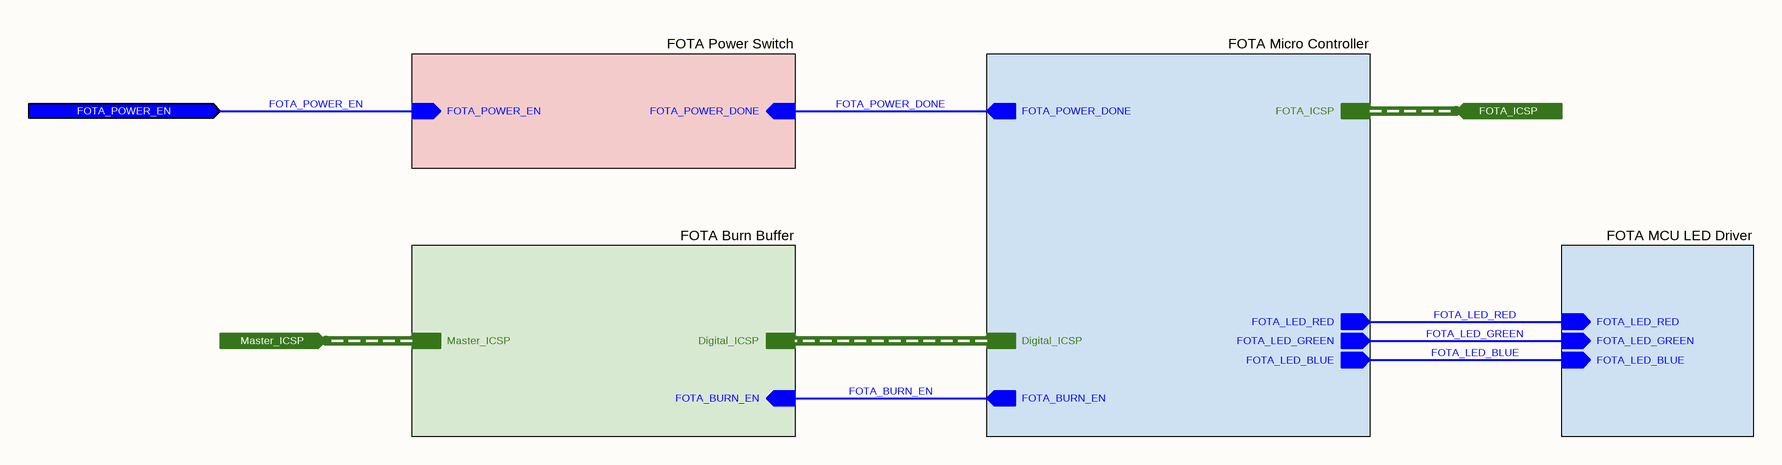
[diagram p7: FOTA.SchDoc]

### Sub-sheets
FOTA Burn Buffer = FOTA Burn Buffer.SchDoc: Digital_ICSP (harness Digital_ICSP), FOTA_BURN_EN (in), Master_ICSP (harness Master_ICSP)
FOTA MCU LED Driver = FOTA LED Driver.SchDoc: FOTA_LED_RED (in), FOTA_LED_BLUE (in), FOTA_LED_GREEN (in)
FOTA Micro Controller = FOTA Micro Controller.SchDoc: FOTA_BURN_EN (out), FOTA_POWER_DONE (out), FOTA_LED_RED (out), FOTA_LED_GREEN (out), FOTA_LED_BLUE (out), Digital_ICSP (harness Digital_ICSP), FOTA_ICSP (harness FOTA_ICSP)
FOTA Power Switch = FOTA Microcontroller Power Switch.SchDoc: FOTA_POWER_DONE (in), FOTA_POWER_EN (in)

### Ports
FOTA_ICSP (in, harness FOTA_ICSP), FOTA_POWER_EN (in), Master_ICSP (in, harness Master_ICSP)

### Nets
FOTA_BURN_EN: sheet FOTA Micro Controller/FOTA_BURN_EN, sheet FOTA Burn Buffer/FOTA_BURN_EN
FOTA_LED_BLUE: sheet FOTA MCU LED Driver/FOTA_LED_BLUE, sheet FOTA Micro Controller/FOTA_LED_BLUE
FOTA_LED_GREEN: sheet FOTA MCU LED Driver/FOTA_LED_GREEN, sheet FOTA Micro Controller/FOTA_LED_GREEN
FOTA_LED_RED: sheet FOTA MCU LED Driver/FOTA_LED_RED, sheet FOTA Micro Controller/FOTA_LED_RED
FOTA_POWER_DONE: sheet FOTA Power Switch/FOTA_POWER_DONE, sheet FOTA Micro Controller/FOTA_POWER_DONE
FOTA_POWER_EN: port FOTA_POWER_EN, sheet FOTA Power Switch/FOTA_POWER_EN

### Buses and harness runs
harness port FOTA_ICSP = sheet FOTA Micro Controller/FOTA_ICSP
harness port Master_ICSP = sheet FOTA Burn Buffer/Master_ICSP
harness sheet FOTA Burn Buffer/Digital_ICSP = sheet FOTA Micro Controller/Digital_ICSP

### Notes on the sheet
- © 2021 All rights reserved.
  This document may not, in whole or in part, be copied, photocopied, reproduced, translated or converted to any electronic or machine readable from without prior written permission of Mehmet Günce Akkoyun.
  Engineer contact : akkoyun@me.com
- Property of
- Engineer :
- Date :
- Size :
- A4
- Time :
- Project :
- Page :
- /
- Customer :
- Product ID :
- Module ID :
- Version :
- File :
- Revision :

## Sheet FOTA LED Driver.SchDoc: FOTA LED Driver
size 292 x 193 mm; SheetNumber: 23; SheetTotal: 28
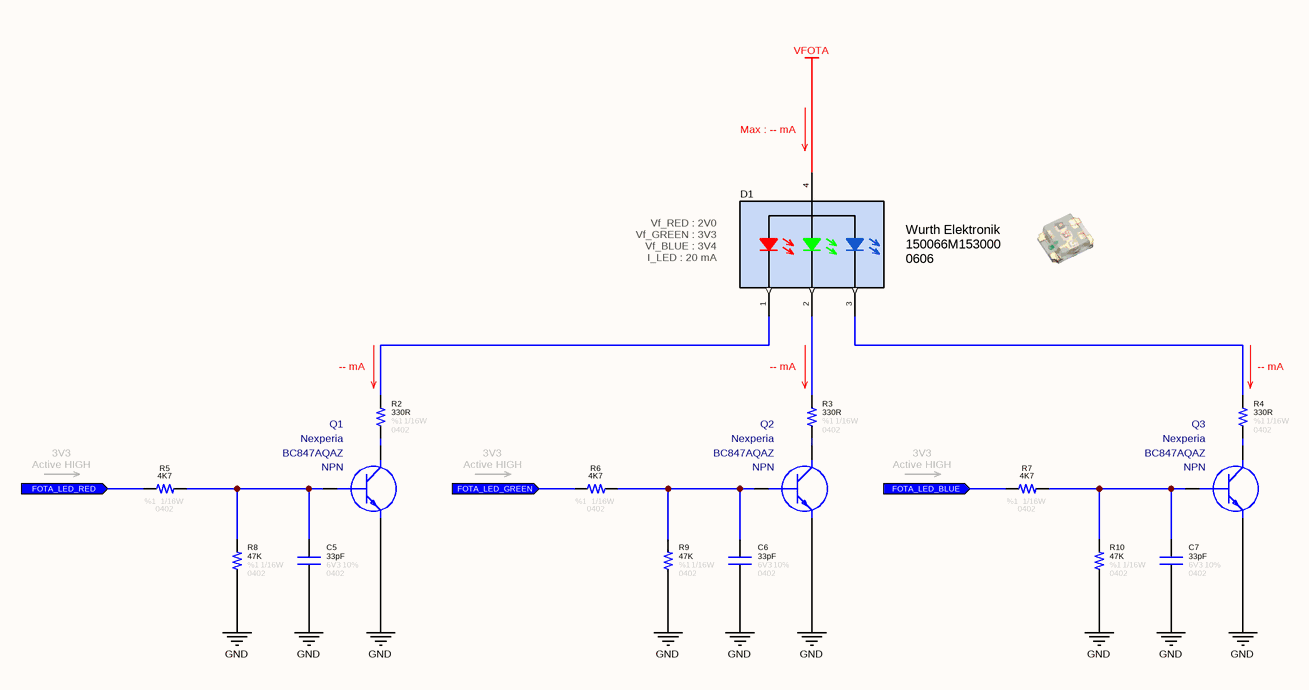
[diagram p8: FOTA LED Driver.SchDoc]

### Parts
C5  value 33pF  Tolerance: 10%  Case: 0402  Voltage: 6V3  [CAPACITOR_0402]  (hidden comment: Capacitor - 33pF [0402] (Ceramic))
C6  value 33pF  Tolerance: 10%  Case: 0402  Voltage: 6V3  [CAPACITOR_0402]  (hidden comment: Capacitor - 33pF [0402] (Ceramic))
C7  value 33pF  Tolerance: 10%  Case: 0402  Voltage: 6V3  [CAPACITOR_0402]  (hidden comment: Capacitor - 33pF [0402] (Ceramic))
D1  Manufacturer Name: Wurth Elektronik  Case: 0606  [Wurth_0606]  (hidden comment: 150066M153000)
Q1  Manufacturer Name: Nexperia  Polarity: NPN  [SOT1215]  (hidden comment: BC847AQAZ)
Q2  Manufacturer Name: Nexperia  Polarity: NPN  [SOT1215]  (hidden comment: BC847AQAZ)
Q3  Manufacturer Name: Nexperia  Polarity: NPN  [SOT1215]  (hidden comment: BC847AQAZ)
R2  value 330R  Case: 0402  Tolerance: %1  Power: 1/16W  [RESISTOR_0402]  (hidden comment: 330R - 0402 - %1 - 1/16W)
R3  value 330R  Case: 0402  Tolerance: %1  Power: 1/16W  [RESISTOR_0402]  (hidden comment: 330R - 0402 - %1 - 1/16W)
R4  value 330R  Case: 0402  Tolerance: %1  Power: 1/16W  [RESISTOR_0402]  (hidden comment: 330R - 0402 - %1 - 1/16W)
R5  value 4K7  Tolerance: %1  Case: 0402  Power: 1/16W  [RESISTOR_0402]  (hidden comment: 4K7 - 0402 - %1 - 1/16W)
R6  value 4K7  Tolerance: %1  Case: 0402  Power: 1/16W  [RESISTOR_0402]  (hidden comment: 4K7 - 0402 - %1 - 1/16W)
R7  value 4K7  Tolerance: %1  Case: 0402  Power: 1/16W  [RESISTOR_0402]  (hidden comment: 4K7 - 0402 - %1 - 1/16W)
R8  value 47K  Tolerance: %1  Case: 0402  Power: 1/16W  [RESISTOR_0402]  (hidden comment: 47K - 0402 - %1 - 1/16W)
R9  value 47K  Tolerance: %1  Case: 0402  Power: 1/16W  [RESISTOR_0402]  (hidden comment: 47K - 0402 - %1 - 1/16W)
R10  value 47K  Tolerance: %1  Case: 0402  Power: 1/16W  [RESISTOR_0402]  (hidden comment: 47K - 0402 - %1 - 1/16W)

### Ports
FOTA_LED_BLUE (in), FOTA_LED_GREEN (in), FOTA_LED_RED (in)

### Nets
GND: C5.1 C6.1 C7.1 Q1.2(E) Q2.2(E) Q3.2(E) R8.1 R9.1 R10.1
VFOTA: D1.4
FOTA_LED_BLUE: R7.2 ; port FOTA_LED_BLUE
FOTA_LED_GREEN: R6.2 ; port FOTA_LED_GREEN
FOTA_LED_RED: R5.2 ; port FOTA_LED_RED
NetC5_2: C5.2 Q1.1(B) R5.1 R8.2
NetC6_2: C6.2 Q2.1(B) R6.1 R9.2
NetC7_2: C7.2 Q3.1(B) R7.1 R10.2
NetD1_1: D1.1 R2.2
NetD1_2: D1.2 R3.2
NetD1_3: D1.3 R4.2
NetQ1_3: Q1.3(C) R2.1
NetQ2_3: Q2.3(C) R3.1
NetQ3_3: Q3.3(C) R4.1

### Notes on the sheet
- Max : -- mA
- (near D1) Vf_RED : 2V0
  Vf_GREEN : 3V3
  Vf_BLUE : 3V4
  I_LED : 20 mA
- (near R2) -- mA
- (near R3) -- mA
- (near R4) -- mA
- 3V3
  Active HIGH
- © 2021 All rights reserved.
  This document may not, in whole or in part, be copied, photocopied, reproduced, translated or converted to any electronic or machine readable from without prior written permission of Mehmet Günce Akkoyun.
  Engineer contact : akkoyun@me.com
- Property of
- Engineer :
- Date :
- Size :
- A4
- Time :
- Project :
- Page :
- /
- Customer :
- Product ID :
- Module ID :
- Version :
- File :
- Revision :

### Library data of the parts
C5-C7 = Capacitor - 33pF [0402-6V3]: as C72 on sheet Port L Output Port; ComponentLink1Description: DataSheet; ComponentLink1URL: https://api.kemet.com/component-edge/download/datasheet/C0402C330J9RACAUTO.pdf; ComponentLink2Description: Mouser; ComponentLink2URL: https://www.mouser.com/Search/Refine.aspx?Keyword=80-C0402C330J9RAUTO
D1 = Diode - LED-RGB: LED RGB DIFFUSED SMD; If - Forward Current: 20 mA; Vf - Forward Voltage: 2 V, 3.3 V; Product Type: LED; Minimum Operating Temperature: - 40 C; Maximum Operating Temperature: + 85 C; ROHS: Yes; Manufacturer Part Number: 150066M153000
Q1-Q3 = Transistor - BC847: Bipolar NPN Transistors; Case: DFN-1010D-3; Manufacturer Part Number: BC847AQAZ
R2-R4 = Resistor - 330R [0402]: Thick Film Resistors - SMD 1/16 W 330 Ohm 1%; Manufacturer Name: Vishay; Manufacturer Part Number: CRCW0402330RFKED; ComponentLink1Description: DataSheet; ComponentLink1URL: https://www.mouser.com.tr/datasheet/2/427/dcrcwe3-1762152.pdf; ComponentLink2Description: Mouser; ComponentLink2URL: https://www.mouser.com.tr/ProductDetail/Vishay-Dale/CRCW0402330RFKED?qs=sGAEpiMZZMu61qfTUdNhG2DpbjADlD3GGS6SwBlLi5Q%3D
R5-R7 = Resistor - 4K7 [0402]: Thick Film Resistors - SMD 1/16 W 4.7 KOhm 1%; Manufacturer Name: Vishay; Manufacturer Part Number: CRCW04024K70FKED; ComponentLink1Description: DataSheet; ComponentLink1URL: https://www.mouser.com.tr/datasheet/2/427/dcrcwe3-1762152.pdf; ComponentLink2Description: Mouser; ComponentLink2URL: https://www.mouser.com.tr/ProductDetail/Vishay-Dale/CRCW04024K70FKED?qs=sGAEpiMZZMu61qfTUdNhG7nHf%2F6MTUn3HadIdDQu24Q%3D
R8-R10 = Resistor - 47K [0402]: Thick Film Resistors - SMD 1/16 W 47 KOhm 1%; Manufacturer Name: Vishay; Manufacturer Part Number: CRCW040247K0FKED; ComponentLink1Description: DataSheet; ComponentLink1URL: https://www.mouser.com.tr/datasheet/2/427/dcrcwe3-1762152.pdf; ComponentLink2Description: Mouser; ComponentLink2URL: https://www.mouser.com.tr/ProductDetail/Vishay-Dale/CRCW040247K0FKED?qs=sGAEpiMZZMu61qfTUdNhG2DpbjADlD3GL%252B3h1elTxqU%3D

## Sheet FOTA Microcontroller Power Switch.SchDoc: FOTA MicroController Latched Power Trigger
size 292 x 193 mm; SheetNumber: 24; SheetTotal: 28
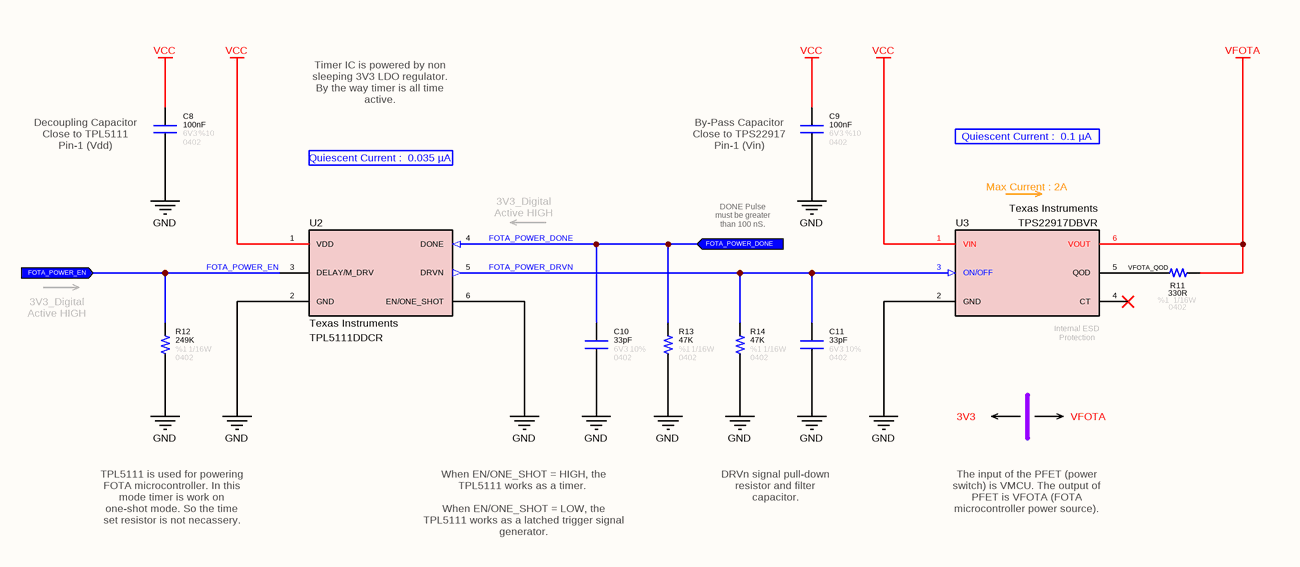
[diagram p9: FOTA Microcontroller Power Switch.SchDoc]

### Parts
C8  value 100nF  Tolerance: %10  Voltage: 6V3  Case: 0402  [CAPACITOR_0402]  (hidden comment: Capacitor - 100nF [0402] (Ceramic))
C9  value 100nF  Tolerance: %10  Voltage: 6V3  Case: 0402  [CAPACITOR_0402]  (hidden comment: Capacitor - 100nF [0402] (Ceramic))
C10  value 33pF  Tolerance: 10%  Case: 0402  Voltage: 6V3  [CAPACITOR_0402]  (hidden comment: Capacitor - 33pF [0402] (Ceramic))
C11  value 33pF  Tolerance: 10%  Case: 0402  Voltage: 6V3  [CAPACITOR_0402]  (hidden comment: Capacitor - 33pF [0402] (Ceramic))
R11  value 330R  Case: 0402  Tolerance: %1  Power: 1/16W  [RESISTOR_0402]  (hidden comment: 330R - 0402 - %1 - 1/16W)
R12  value 249K  Power: 1/16W  Case: 0402  Tolerance: %1  [RESISTOR_0402]  (hidden comment: 249K - 0402 - %1 - 1/16W)
R13  value 47K  Tolerance: %1  Case: 0402  Power: 1/16W  [RESISTOR_0402]  (hidden comment: 47K - 0402 - %1 - 1/16W)
R14  value 47K  Tolerance: %1  Case: 0402  Power: 1/16W  [RESISTOR_0402]  (hidden comment: 47K - 0402 - %1 - 1/16W)
U2  Manufacturer Name: Texas Instruments  [SOT-23-6]  (hidden comment: TPL5111DDCR)
U3  Manufacturer Part Number: TPS22917DBVR  Manufacturer Name: Texas Instruments  [SOT-23-6]  (hidden comment: Power Switch)

### Ports
FOTA_POWER_DONE (in), FOTA_POWER_EN (in)

### Nets
GND: C8.1 C9.1 C10.1 C11.1 R12.1 R13.1 R14.1 U2.2(GND) U2.6(EN/ONE_SHOT) U3.2(GND)
VCC: C8.2 C9.2 U2.1(VDD) U3.1(VIN)
VFOTA: R11.1 U3.6(VOUT)
FOTA_POWER_DONE: C10.2 R13.2 U2.4(DONE) ; port FOTA_POWER_DONE
FOTA_POWER_DRVN: C11.2 R14.2 U2.5(DRVN) U3.3(ON/OFF)
FOTA_POWER_EN: R12.2 U2.3(DELAY/M_DRV) ; port FOTA_POWER_EN
VFOTA_QOD: R11.2 U3.5(QOD)

Not connected (* = marked no-connect by the designer): U3 4(CT)*

### Notes on the sheet
- (near C8) Decoupling Capacitor
  Close to TPL5111
  Pin-1 (Vdd)
- Quiescent Current :  0.035 µA
- Timer IC is powered by non sleeping 3V3 LDO regulator. By the way timer is all time active.
- (near C9) By-Pass Capacitor
  Close to TPS22917
  Pin-1 (Vin)
- Quiescent Current :  0.1 µA
- (near U2) 3V3_Digital
  Active HIGH
- DONE Pulse must be greater than 100 nS.
- (near U3) Max Current : 2A
- 3V3_Digital
  Active HIGH
- (near U3) Internal ESD Protection
- 3V3
- VFOTA
- DRVn signal pull-down resistor and filter capacitor.
- TPL5111 is used for powering FOTA microcontroller. In this mode timer is work on one-shot mode. So the time set resistor is not necassery.
- When EN/ONE_SHOT = HIGH, the TPL5111 works as a timer.
  When EN/ONE_SHOT = LOW, the TPL5111 works as a latched trigger signal generator.
- The input of the PFET (power switch) is VMCU. The output of PFET is VFOTA (FOTA microcontroller power source).
- © 2021 All rights reserved.
  This document may not, in whole or in part, be copied, photocopied, reproduced, translated or converted to any electronic or machine readable from without prior written permission of Mehmet Günce Akkoyun.
  Engineer contact : akkoyun@me.com
- Property of
- Engineer :
- Date :
- Size :
- A4
- Time :
- Project :
- Page :
- /
- Customer :
- Product ID :
- Module ID :
- Version :
- File :
- Revision :

### Library data of the parts
C8 C9 = Capacitor - 100nF [0402-6V3]: Capacitor - 100nF [0402-6V3] (Ceramic); Manufacturer Name: AVX; Manufacturer Part Number: 04026D104KAT4A; ComponentLink1Description: Mouser; ComponentLink1URL: https://www.mouser.com.tr/ProductDetail/AVX/04026D104KAT4A?qs=sGAEpiMZZMs0AnBnWHyRQPg4iYkCw7IMED%2F4kpqgf7w%3D; ComponentLink2Description: DataSheet; ComponentLink2URL: https://www.mouser.com.tr/datasheet/2/40/cx5r-776519.pdf
C10 C11 = Capacitor - 33pF [0402-6V3]: as C72 on sheet Port L Output Port; ComponentLink1Description: DataSheet; ComponentLink1URL: https://api.kemet.com/component-edge/download/datasheet/C0402C330J9RACAUTO.pdf; ComponentLink2Description: Mouser; ComponentLink2URL: https://www.mouser.com/Search/Refine.aspx?Keyword=80-C0402C330J9RAUTO
R11 = Resistor - 330R [0402]: as R2 on sheet FOTA LED Driver; ComponentLink1Description: DataSheet; ComponentLink1URL: https://www.mouser.com.tr/datasheet/2/427/dcrcwe3-1762152.pdf; ComponentLink2Description: Mouser; ComponentLink2URL: https://www.mouser.com.tr/ProductDetail/Vishay-Dale/CRCW0402330RFKED?qs=sGAEpiMZZMu61qfTUdNhG2DpbjADlD3GGS6SwBlLi5Q%3D
R12 = Resistor - 249K [0402]: Thick Film Resistors - SMD 1/16 W 249 KOhm 1%; Manufacturer Name: Vishay; Manufacturer Part Number: CRCW0402249KFKED
R13 R14 = Resistor - 47K [0402]: as R8 on sheet FOTA LED Driver; ComponentLink1Description: DataSheet; ComponentLink1URL: https://www.mouser.com.tr/datasheet/2/427/dcrcwe3-1762152.pdf; ComponentLink2Description: Mouser; ComponentLink2URL: https://www.mouser.com.tr/ProductDetail/Vishay-Dale/CRCW040247K0FKED?qs=sGAEpiMZZMu61qfTUdNhG2DpbjADlD3GL%252B3h1elTxqU%3D
U2 = IC - TPL5111: NANO-POWER SYSTEM TIMER FOR POWE; Maximum Operating Temperature: + 105 C; Minimum Operating Temperature: - 40 C; RoHS: Yes; Case: SOT-23-6; Product Type: Timers; Manufacturer Part Number: TPL5111DDCR
U3 = IC - TPS22917: Power Switch MosFet; Height: 1.45mm; ComponentLink1Description: DataSheet; ComponentLink1URL: http://www.ti.com/lit/gpn/tps22917; ComponentLink2Description: Mouser; ComponentLink2URL: https://www.mouser.com/Search/Refine.aspx?Keyword=595-TPS22917DBVR; Case: SOT-23-6

## Sheet FOTA Micro Controller.SchDoc: FOTA MicroController
size 292 x 193 mm; SheetNumber: 22; SheetTotal: 28
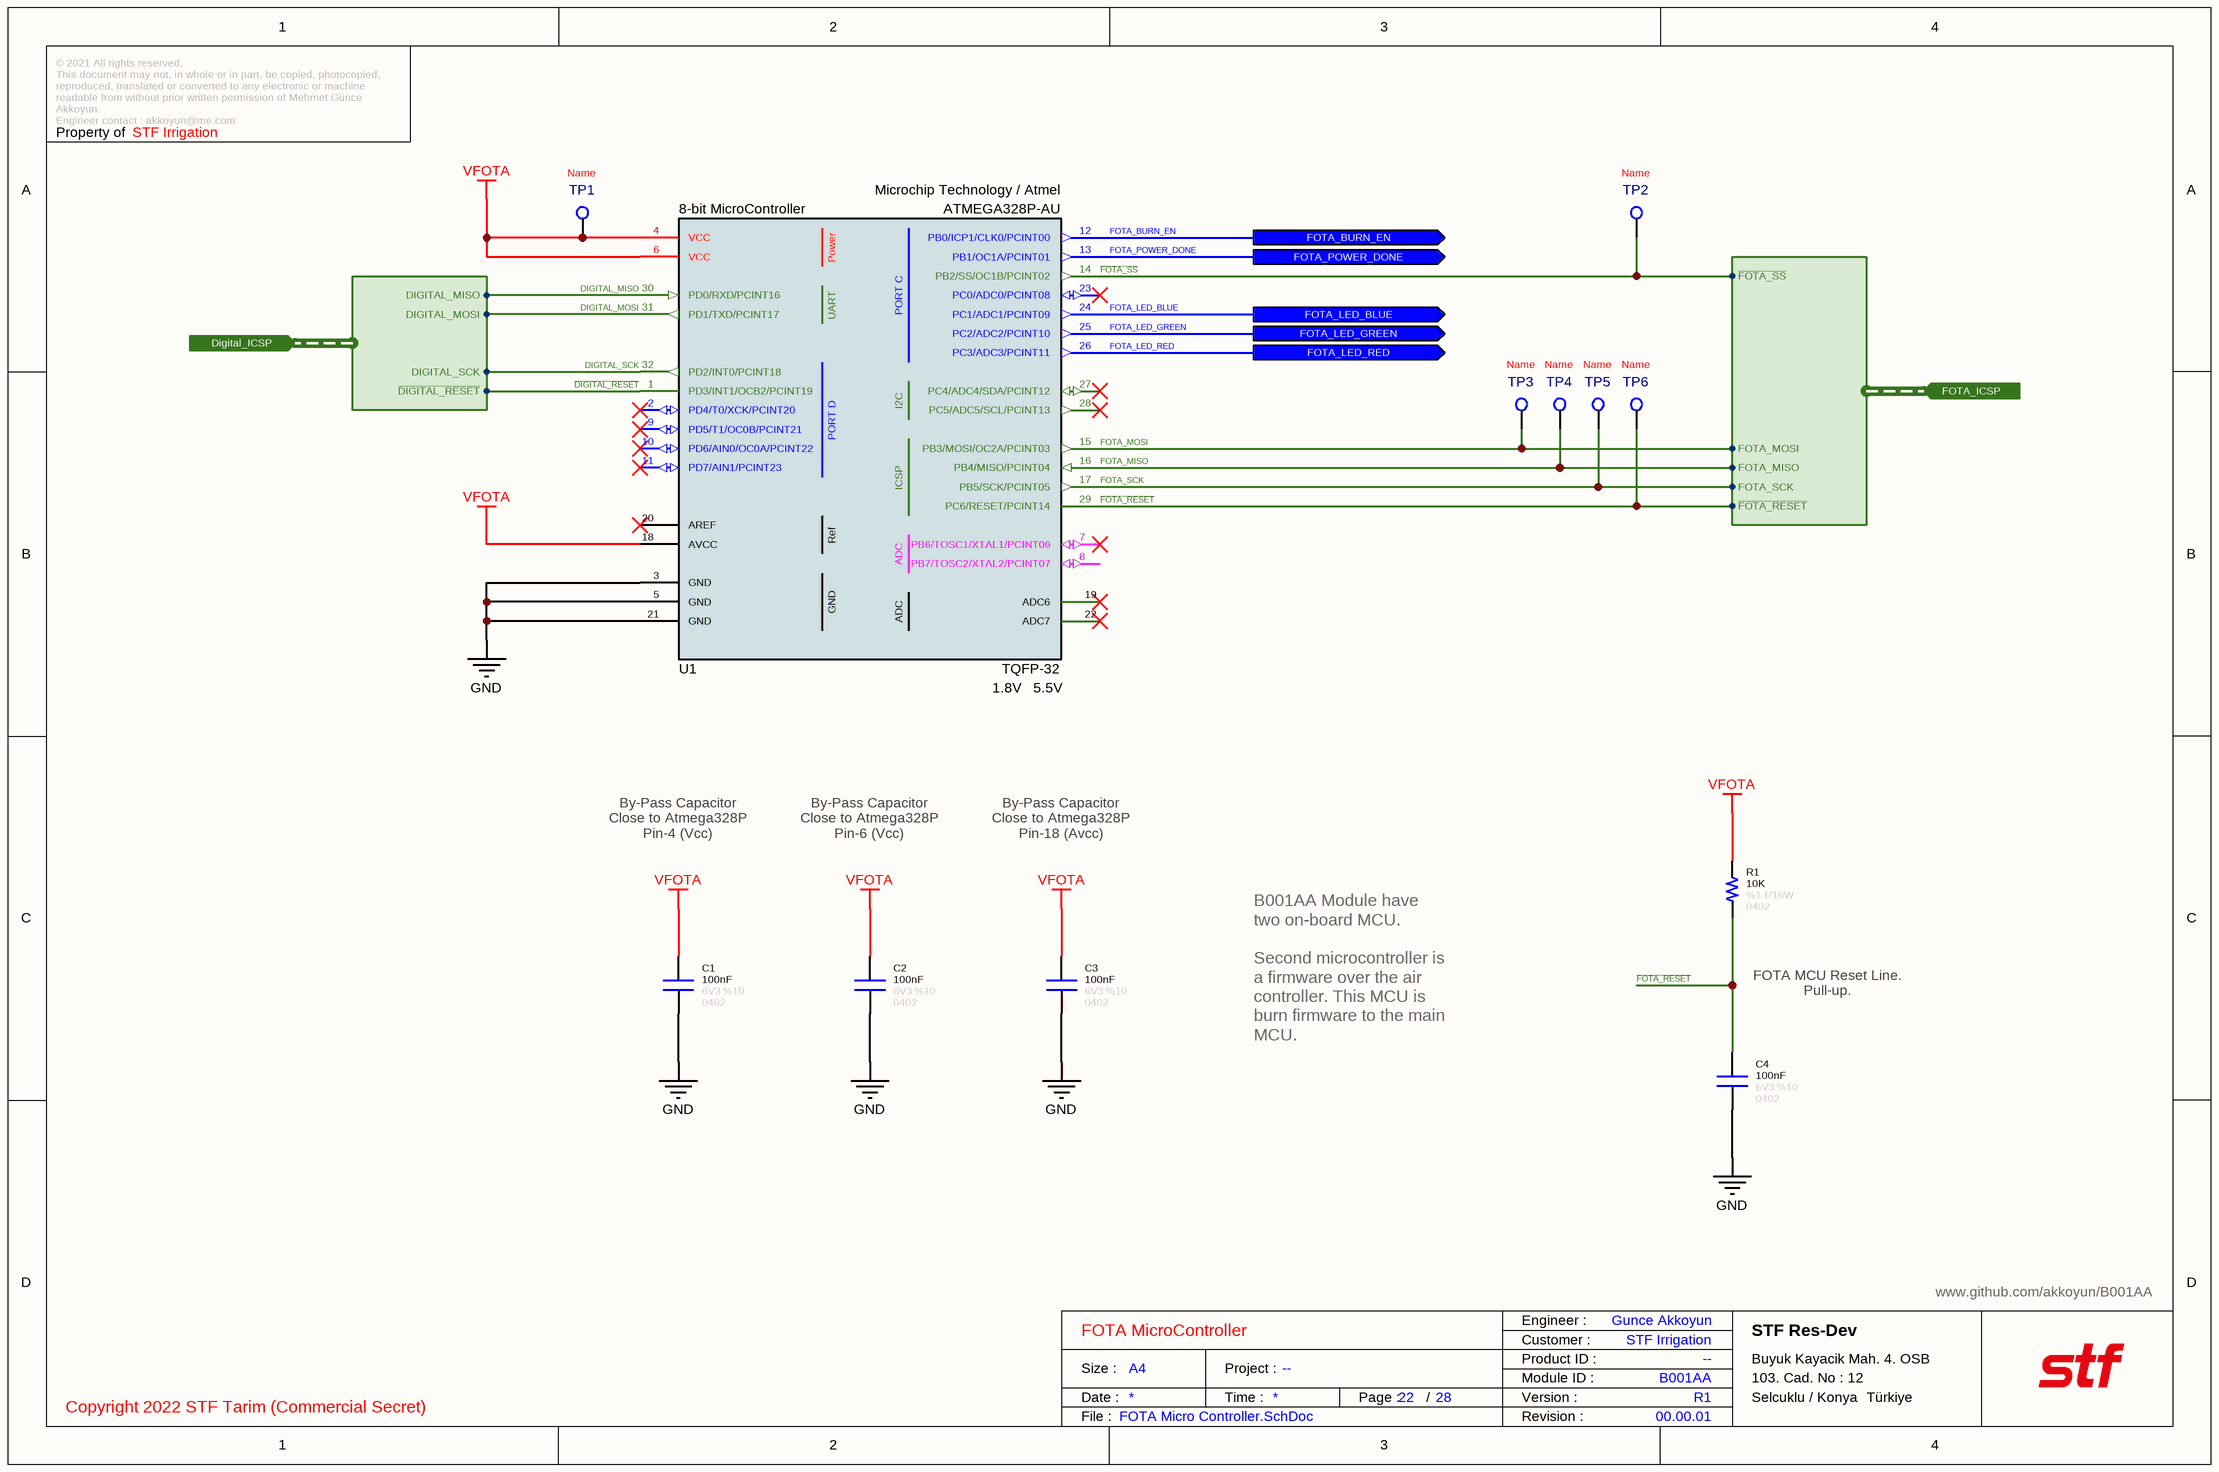
[diagram p10: FOTA Micro Controller.SchDoc]

### Parts
C1  value 100nF  Tolerance: %10  Voltage: 6V3  Case: 0402  [CAPACITOR_0402]  (hidden comment: Capacitor - 100nF [0402] (Ceramic))
C2  value 100nF  Tolerance: %10  Voltage: 6V3  Case: 0402  [CAPACITOR_0402]  (hidden comment: Capacitor - 100nF [0402] (Ceramic))
C3  value 100nF  Tolerance: %10  Voltage: 6V3  Case: 0402  [CAPACITOR_0402]  (hidden comment: Capacitor - 100nF [0402] (Ceramic))
C4  value 100nF  Tolerance: %10  Voltage: 6V3  Case: 0402  [CAPACITOR_0402]  (hidden comment: Capacitor - 100nF [0402] (Ceramic))
R1  value 10K  Tolerance: %1  Case: 0402  Power: 1/16W  [RESISTOR_0402]  (hidden comment: 10K - 0402 - %1 - 1/16W)
TP1  PCB - Test Point  [Test_Point]  (value not drawn)  (no BOM)
TP2  PCB - Test Point  [Test_Point]  (value not drawn)  (no BOM)
TP3  PCB - Test Point  [Test_Point]  (value not drawn)  (no BOM)
TP4  PCB - Test Point  [Test_Point]  (value not drawn)  (no BOM)
TP5  PCB - Test Point  [Test_Point]  (value not drawn)  (no BOM)
TP6  PCB - Test Point  [Test_Point]  (value not drawn)  (no BOM)
U1  8-bit MicroController  Supply Voltage - Max: 5.5V  Supply Voltage - Min: 1.8V  Manufacturer Name: Microchip Technology / Atmel  Manufacturer Part Number: ATMEGA328P-AU  Case: TQFP-32  [TQFN-32]

### Ports
Digital_ICSP (in, harness Digital_ICSP), FOTA_BURN_EN (out), FOTA_ICSP (in, harness FOTA_ICSP), FOTA_LED_BLUE (out), FOTA_LED_GREEN (out), FOTA_LED_RED (out), FOTA_POWER_DONE (out)

### Harnesses
Digital_ICSP: ~{DIGITAL_RESET}, DIGITAL_SCK, DIGITAL_MOSI, DIGITAL_MISO
FOTA_ICSP: ~{FOTA_SS}, FOTA_MOSI, FOTA_MISO, FOTA_SCK, ~{FOTA_RESET}

### Nets
GND: C1.1 C2.1 C3.1 C4.1 U1.3(GND) U1.5(GND) U1.21(GND)
VFOTA: C1.2 C2.2 C3.2 R1.2 TP1.1 U1.4(VCC) U1.6(VCC) U1.18(AVCC)
~{DIGITAL_RESET}: U1.1(PD3/INT1/OCB2/PCINT19) ; port Digital_ICSP.~{DIGITAL_RESET}
DIGITAL_MISO: U1.30(PD0/RXD/PCINT16) ; port Digital_ICSP.DIGITAL_MISO
DIGITAL_MOSI: U1.31(PD1/TXD/PCINT17) ; port Digital_ICSP.DIGITAL_MOSI
DIGITAL_SCK: U1.32(PD2/INT0/PCINT18) ; port Digital_ICSP.DIGITAL_SCK
~{FOTA_RESET}: C4.2 R1.1 TP6.1 U1.29(PC6/RESET/PCINT14) ; port FOTA_ICSP.~{FOTA_RESET}
~{FOTA_SS}: TP2.1 U1.14(PB2/SS/OC1B/PCINT02) ; port FOTA_ICSP.~{FOTA_SS}
FOTA_BURN_EN: U1.12(PB0/ICP1/CLK0/PCINT00) ; port FOTA_BURN_EN
FOTA_LED_BLUE: U1.24(PC1/ADC1/PCINT09) ; port FOTA_LED_BLUE
FOTA_LED_GREEN: U1.25(PC2/ADC2/PCINT10) ; port FOTA_LED_GREEN
FOTA_LED_RED: U1.26(PC3/ADC3/PCINT11) ; port FOTA_LED_RED
FOTA_MISO: TP4.1 U1.16(PB4/MISO/PCINT04) ; port FOTA_ICSP.FOTA_MISO
FOTA_MOSI: TP3.1 U1.15(PB3/MOSI/OC2A/PCINT03) ; port FOTA_ICSP.FOTA_MOSI
FOTA_POWER_DONE: U1.13(PB1/OC1A/PCINT01) ; port FOTA_POWER_DONE
FOTA_SCK: TP5.1 U1.17(PB5/SCK/PCINT05) ; port FOTA_ICSP.FOTA_SCK

Not connected (* = marked no-connect by the designer): U1 2(PD4/T0/XCK/PCINT20)* 7(PB6/TOSC1/XTAL1/PCINT06)* 8(PB7/TOSC2/XTAL2/PCINT07) 9(PD5/T1/OC0B/PCINT21)* 10(PD6/AIN0/OC0A/PCINT22)* 11(PD7/AIN1/PCINT23)* 19(ADC6)* 20(AREF)* 22(ADC7)* 23(PC0/ADC0/PCINT08)* 27(PC4/ADC4/SDA/PCINT12)* 28(PC5/ADC5/SCL/PCINT13)*

### Notes on the sheet
- By-Pass Capacitor
  Close to Atmega328P
  Pin-4 (Vcc)
- By-Pass Capacitor
  Close to Atmega328P
  Pin-6 (Vcc)
- By-Pass Capacitor
  Close to Atmega328P
  Pin-18 (Avcc)
- FOTA MCU Reset Line. Pull-up.
- B001AA Module have two on-board MCU.
  Second microcontroller is a firmware over the air controller. This MCU is burn firmware to the main MCU.
- © 2021 All rights reserved.
  This document may not, in whole or in part, be copied, photocopied, reproduced, translated or converted to any electronic or machine readable from without prior written permission of Mehmet Günce Akkoyun.
  Engineer contact : akkoyun@me.com
- Property of
- Engineer :
- Date :
- Size :
- A4
- Time :
- Project :
- Page :
- /
- Customer :
- Product ID :
- Module ID :
- Version :
- File :
- Revision :
- (in symbol IC - ATMEGA328P-AU) Power; PORT C; UART; I2C; PORT D; ICSP; Ref; ADC

### Library data of the parts
C1-C4 = Capacitor - 100nF [0402-6V3]: as C8 on sheet FOTA Microcontroller Power Switch; ComponentLink1Description: Mouser; ComponentLink1URL: https://www.mouser.com.tr/ProductDetail/AVX/04026D104KAT4A?qs=sGAEpiMZZMs0AnBnWHyRQPg4iYkCw7IMED%2F4kpqgf7w%3D; ComponentLink2Description: DataSheet; ComponentLink2URL: https://www.mouser.com.tr/datasheet/2/40/cx5r-776519.pdf
R1 = Resistor - 10K [0402]: Thick Film Resistors - SMD 1/16 W 10 KOhm 1%; Manufacturer Name: Vishay; Manufacturer Part Number: CRCW040210K0FKED; ComponentLink1Description: DataSheet; ComponentLink1URL: https://www.mouser.com.tr/datasheet/2/427/dcrcwe3-1762152.pdf; ComponentLink2Description: Mouser; ComponentLink2URL: https://www.mouser.com.tr/ProductDetail/Vishay-Dale/CRCW040210K0FKED?qs=sGAEpiMZZMu61qfTUdNhG2DpbjADlD3GcalbOv9utCY%3D
TP1-TP6 = PCB - Test Point: Test Point; Name: Name
U1 = IC - ATMEGA328P-AU: 8-bit Microcontrollers - MCU 32KB In-system Flash 20MHz 1.8V-5.5V; Height: 1mm; ComponentLink1Description: DataSheet; ComponentLink1URL: http://ww1.microchip.com/downloads/en/DeviceDoc/ATmega48A-PA-88A-PA-168A-PA-328-P-DS-DS40002061A.pdf; ROHS: Yes; Minimum Operating Temperature: -40; Maximum Operating Temperature: +85; ComponentLink2Description: Mouser; ComponentLink2URL: https://www.mouser.com.tr/ProductDetail/Microchip-Technology-Atmel/ATMEGA328P-AU?qs=sGAEpiMZZMtVoztFdqDXO3RbBx7FKCmV; ComponentLink3Description: ProductPage; ComponentLink3URL: https://www.microchip.com/wwwproducts/en/ATmega328p

## Sheet FOTA Burn Buffer.SchDoc: FOTA Burn Buffer
size 292 x 193 mm; DocumentNumber: 19; SheetNumber: 25; SheetTotal: 28
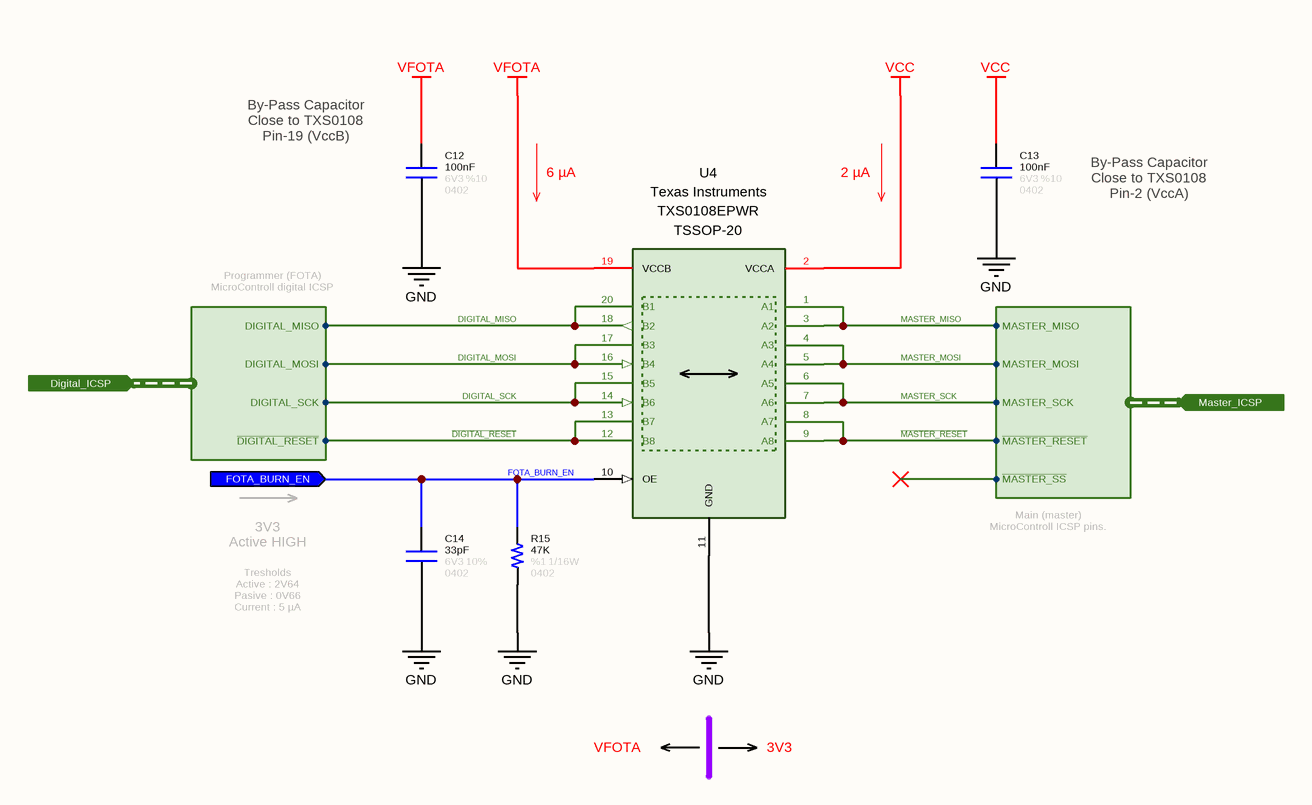
[diagram p11: FOTA Burn Buffer.SchDoc]

### Parts
C12  value 100nF  Tolerance: %10  Voltage: 6V3  Case: 0402  [CAPACITOR_0402]  (hidden comment: Capacitor - 100nF [0402] (Ceramic))
C13  value 100nF  Tolerance: %10  Voltage: 6V3  Case: 0402  [CAPACITOR_0402]  (hidden comment: Capacitor - 100nF [0402] (Ceramic))
C14  value 33pF  Tolerance: 10%  Case: 0402  Voltage: 6V3  [CAPACITOR_0402]  (hidden comment: Capacitor - 33pF [0402] (Ceramic))
R15  value 47K  Tolerance: %1  Case: 0402  Power: 1/16W  [RESISTOR_0402]  (hidden comment: 47K - 0402 - %1 - 1/16W)
U4  Manufacturer Name: Texas Instruments  [TSSOP-20]  (hidden comment: TXS0108EPWR)

### Ports
Digital_ICSP (in, harness Digital_ICSP), FOTA_BURN_EN (in), Master_ICSP (in, harness Master_ICSP)

### Harnesses
Master_ICSP: MASTER_MOSI, MASTER_MISO, MASTER_SCK, ~{MASTER_RESET}, ~{MASTER_SS}
Digital_ICSP: ~{DIGITAL_RESET}, DIGITAL_SCK, DIGITAL_MOSI, DIGITAL_MISO

### Nets
GND: C12.1 C13.1 C14.1 R15.1 U4.11(GND)
VCC: C13.2 U4.2(VCCA)
VFOTA: C12.2 U4.19(VCCB)
~{DIGITAL_RESET}: U4.12(B8) U4.13(B7) ; port Digital_ICSP.~{DIGITAL_RESET}
DIGITAL_MISO: U4.18(B2) U4.20(B1) ; port Digital_ICSP.DIGITAL_MISO
DIGITAL_MOSI: U4.16(B4) U4.17(B3) ; port Digital_ICSP.DIGITAL_MOSI
DIGITAL_SCK: U4.14(B6) U4.15(B5) ; port Digital_ICSP.DIGITAL_SCK
FOTA_BURN_EN: C14.2 R15.2 U4.10(OE) ; port FOTA_BURN_EN
~{MASTER_RESET}: U4.8(A7) U4.9(A8) ; port Master_ICSP.~{MASTER_RESET}
MASTER_MISO: U4.1(A1) U4.3(A2) ; port Master_ICSP.MASTER_MISO
MASTER_MOSI: U4.4(A3) U4.5(A4) ; port Master_ICSP.MASTER_MOSI
MASTER_SCK: U4.6(A5) U4.7(A6) ; port Master_ICSP.MASTER_SCK

### Notes on the sheet
- (near C12) By-Pass Capacitor
  Close to TXS0108
  Pin-19 (VccB)
- 6 µA
- 2 µA
- By-Pass Capacitor
  Close to TXS0108
  Pin-2 (VccA)
- Programmer (FOTA) MicroControll digital ICSP pins.
- 3V3
  Active HIGH
- Main (master) MicroControll ICSP pins.
- Tresholds
  Active : 2V64
  Pasive : 0V66
  Current : 5 µA
- VFOTA
- 3V3
- © 2021 All rights reserved.
  This document may not, in whole or in part, be copied, photocopied, reproduced, translated or converted to any electronic or machine readable from without prior written permission of Mehmet Günce Akkoyun.
  Engineer contact : akkoyun@me.com
- Property of
- Engineer :
- Date :
- Size :
- A4
- Time :
- Project :
- Page :
- /
- Customer :
- Product ID :
- Module ID :
- Version :
- File :
- Revision :

### Library data of the parts
C12 C13 = Capacitor - 100nF [0402-6V3]: as C8 on sheet FOTA Microcontroller Power Switch; ComponentLink1Description: Mouser; ComponentLink1URL: https://www.mouser.com.tr/ProductDetail/AVX/04026D104KAT4A?qs=sGAEpiMZZMs0AnBnWHyRQPg4iYkCw7IMED%2F4kpqgf7w%3D; ComponentLink2Description: DataSheet; ComponentLink2URL: https://www.mouser.com.tr/datasheet/2/40/cx5r-776519.pdf
C14 = Capacitor - 33pF [0402-6V3]: as C72 on sheet Port L Output Port; ComponentLink1Description: DataSheet; ComponentLink1URL: https://api.kemet.com/component-edge/download/datasheet/C0402C330J9RACAUTO.pdf; ComponentLink2Description: Mouser; ComponentLink2URL: https://www.mouser.com/Search/Refine.aspx?Keyword=80-C0402C330J9RAUTO
R15 = Resistor - 47K [0402]: as R8 on sheet FOTA LED Driver; ComponentLink1Description: DataSheet; ComponentLink1URL: https://www.mouser.com.tr/datasheet/2/427/dcrcwe3-1762152.pdf; ComponentLink2Description: Mouser; ComponentLink2URL: https://www.mouser.com.tr/ProductDetail/Vishay-Dale/CRCW040247K0FKED?qs=sGAEpiMZZMu61qfTUdNhG2DpbjADlD3GL%252B3h1elTxqU%3D
U4 = IC - TXS0108: IC 8BIT NON-INV TRANSLTR 20TSSOP; Supply Voltage - Max: 5.5 V; Supply Voltage - Min: 1.2 V, 1.65 V; High Level Output Current: 50 mA; Data Rate: 60 Mb/s; RoHS: Yes; Product Type: Translation ICs; Minimum Operating Temperature: - 40 C; Low Level Output Current: 50 mA; Maximum Operating Temperature: + 85 C; Manufacturer Part Number: TXS0108EPWR; Case: TSSOP-20

## Sheet Master Micro Controller.SchDoc: Main Micro Controller
size 292 x 193 mm; SheetNumber: 9; SheetTotal: 28
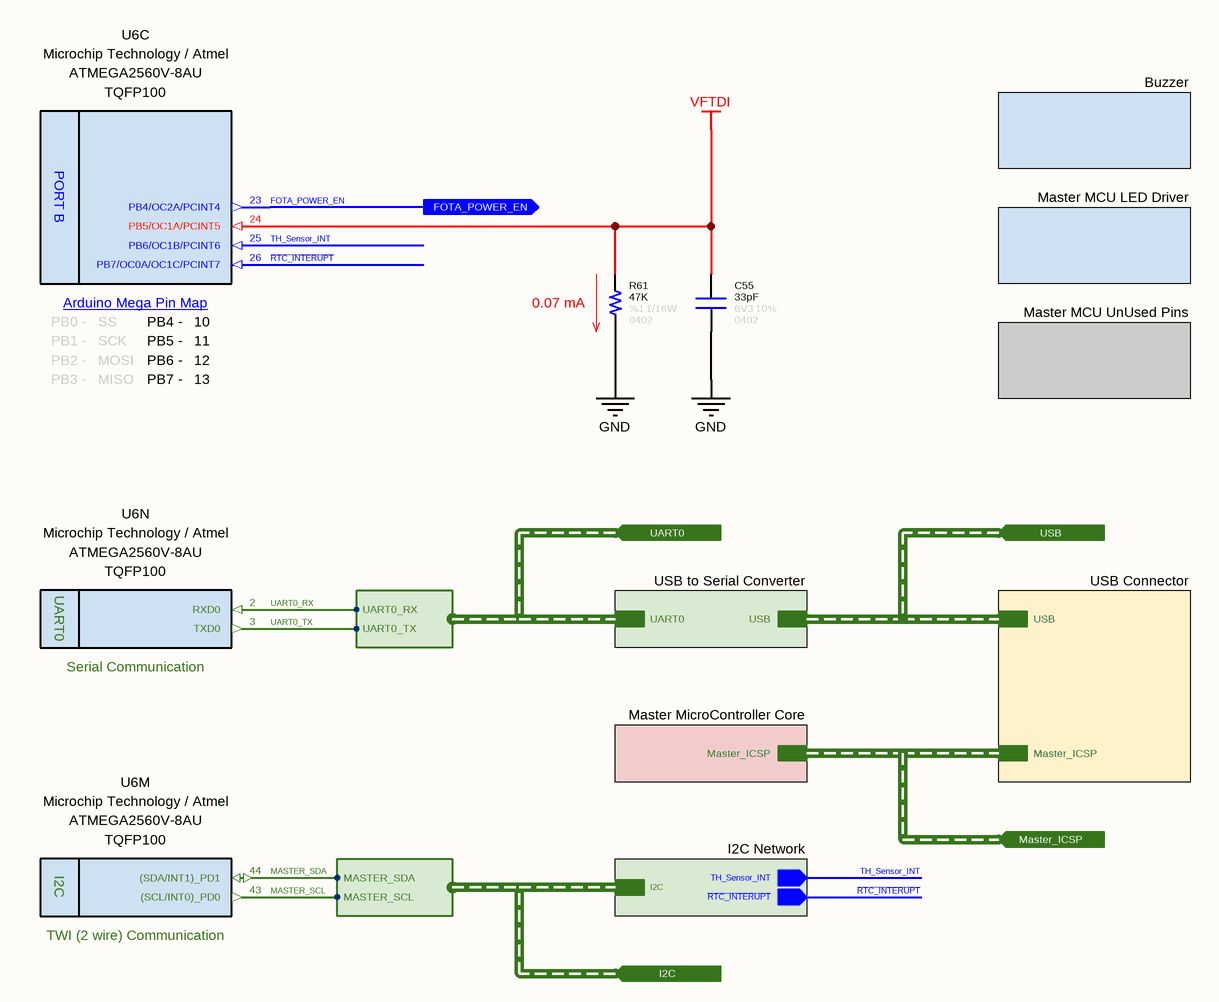
[diagram p12: Master Micro Controller.SchDoc]

### Parts
C55  value 33pF  Tolerance: 10%  Case: 0402  Voltage: 6V3  [CAPACITOR_0402]  (hidden comment: Capacitor - 33pF [0402] (Ceramic))
R61  value 47K  Tolerance: %1  Case: 0402  Power: 1/16W  [RESISTOR_0402]  (hidden comment: 47K - 0402 - %1 - 1/16W)
U6  Manufacturer Name: Microchip Technology / Atmel  Case: TQFP100  [TQFP-100]  (hidden comment: ATMEGA2560V-8AU)  (parts C,M,N of 16)

### Sub-sheets
Buzzer = Buzzer.SchDoc: no entries
I2C Network = I2C Block Diagram.SchDoc: I2C (harness I2C), TH_Sensor_INT (out), ~{RTC_INTERUPT} (out)
Master MCU LED Driver = Master MicroController LED Driver.SchDoc: no entries
Master MCU UnUsed Pins = UnUsed MicroController Pins.SchDoc: no entries
Master MicroController Core = Master Micro Controller Core.SchDoc: Master_ICSP (harness Master_ICSP)
USB Connector = USB Connector.SchDoc: USB (harness USB), Master_ICSP (harness Master_ICSP)
USB to Serial Converter = Serial to USB Converter.SchDoc: USB (harness USB), UART0 (harness UART0)

### Ports
FOTA_POWER_EN (out), I2C (in, harness I2C), Master_ICSP (in, harness Master_ICSP), UART0 (in, harness UART0), USB (in, harness USB)

### Harnesses
UART0: UART0_RX, UART0_TX
I2C: MASTER_SDA, MASTER_SCL

### Nets
GND: C55.1 R61.1
VFTDI: C55.2 R61.2 U6.24(PB5/OC1A/PCINT5)
FOTA_POWER_EN: U6.23(PB4/OC2A/PCINT4) ; port FOTA_POWER_EN
MASTER_SCL: U6.43((SCL/INT0)_PD0) ; port I2C.MASTER_SCL
MASTER_SDA: U6.44((SDA/INT1)_PD1) ; port I2C.MASTER_SDA
~{RTC_INTERUPT}: U6.26(PB7/OC0A/OC1C/PCINT7) ; sheet I2C Network/~{RTC_INTERUPT}
TH_Sensor_INT: U6.25(PB6/OC1B/PCINT6) ; sheet I2C Network/TH_Sensor_INT
UART0_RX: U6.2(RXD0) ; port UART0.UART0_RX
UART0_TX: U6.3(TXD0) ; port UART0.UART0_TX

### Buses and harness runs
harness port I2C = sheet I2C Network/I2C
harness port Master_ICSP = sheet Master MicroController Core/Master_ICSP = sheet USB Connector/Master_ICSP
harness port UART0 = sheet USB to Serial Converter/UART0
harness port USB = sheet USB Connector/USB = sheet USB to Serial Converter/USB

### Notes on the sheet
- (near R61) 0.07 mA
- © 2021 All rights reserved.
  This document may not, in whole or in part, be copied, photocopied, reproduced, translated or converted to any electronic or machine readable from without prior written permission of Mehmet Günce Akkoyun.
  Engineer contact : akkoyun@me.com
- Property of
- Engineer :
- Date :
- Size :
- A4
- Time :
- Project :
- Page :
- /
- Customer :
- Product ID :
- Module ID :
- Version :
- File :
- Revision :
- (in symbol IC - AtMega2560V-8AU, part C) PORT B; Arduino Mega Pin Map; PB0 -; SS; PB4 -; PB1 -; SCK; PB5 -; PB2 -; MOSI; PB6 -; PB3 -; MISO; PB7 -
- (in symbol IC - AtMega2560V-8AU, part M) I2C; TWI (2 wire) Communication
- (in symbol IC - AtMega2560V-8AU, part N) UART0; Serial Communication

### Library data of the parts
C55 = Capacitor - 33pF [0402-6V3]: as C72 on sheet Port L Output Port; ComponentLink1Description: DataSheet; ComponentLink1URL: https://api.kemet.com/component-edge/download/datasheet/C0402C330J9RACAUTO.pdf; ComponentLink2Description: Mouser; ComponentLink2URL: https://www.mouser.com/Search/Refine.aspx?Keyword=80-C0402C330J9RAUTO
R61 = Resistor - 47K [0402]: as R8 on sheet FOTA LED Driver; ComponentLink1Description: DataSheet; ComponentLink1URL: https://www.mouser.com.tr/datasheet/2/427/dcrcwe3-1762152.pdf; ComponentLink2Description: Mouser; ComponentLink2URL: https://www.mouser.com.tr/ProductDetail/Vishay-Dale/CRCW040247K0FKED?qs=sGAEpiMZZMu61qfTUdNhG2DpbjADlD3GL%252B3h1elTxqU%3D
U6 = IC - AtMega2560V-8AU: as U6 on sheet Port L Output Port; Maximum Operating Temperature: + 85 C; Product Type: MicroControllers; Minimum Operating Temperature: - 40 C; Manufacturer Part Number: ATMEGA2560V-8AU